# Altium project extension.PrjPcb (part 1 of 2)
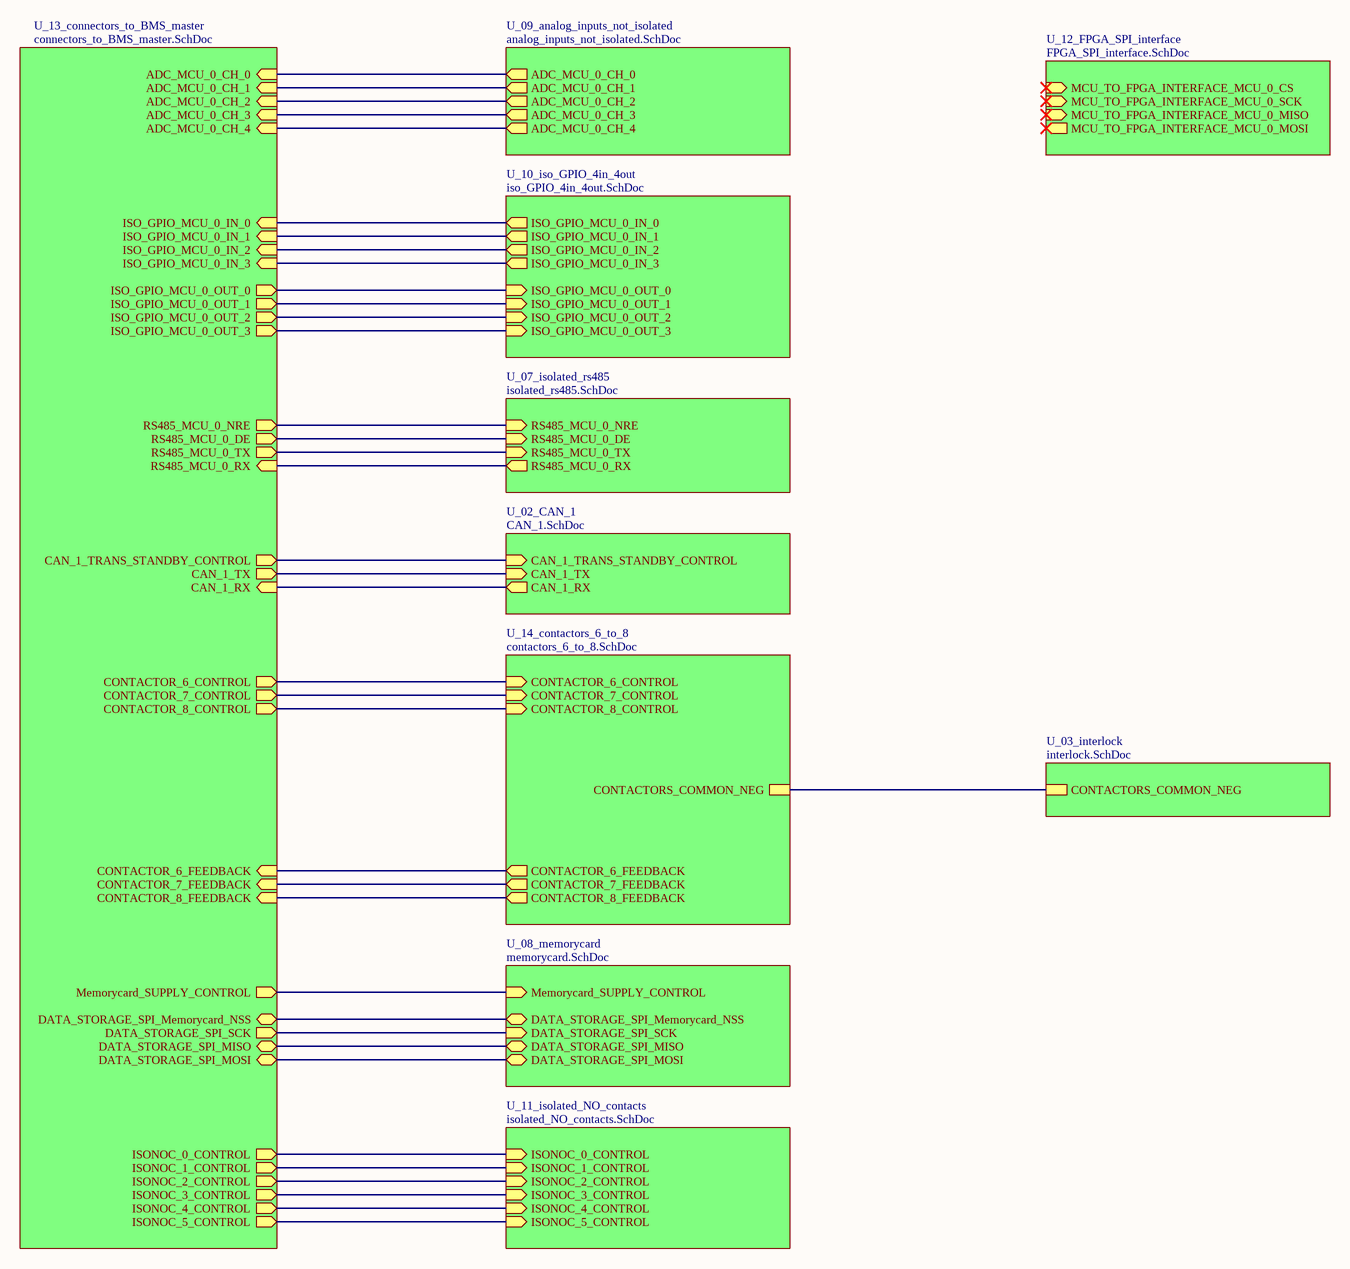
[diagram p0: hierarchy.SchDoc]
GlobalDate: 2018-10-25; GlobalLicense: Creative Commons Attribution 4.0; GlobalProject: foxBMS BMS-Extension; GlobalVersion: 1.0.5
14 sheets, 219 parts. Net scope: hierarchical (ports join the sheet entries above them; power ports are global).
Board file: extension.PcbDoc
Sheets:
  hierarchy.SchDoc
    U_02_CAN_1 = CAN_1.SchDoc
    U_03_interlock = interlock.SchDoc
    U_07_isolated_rs485 = isolated_rs485.SchDoc
    U_08_memorycard = memorycard.SchDoc
    U_09_analog_inputs_not_isolated = analog_inputs_not_isolated.SchDoc
    U_10_iso_GPIO_4in_4out = iso_GPIO_4in_4out.SchDoc
    U_11_isolated_NO_contacts = isolated_NO_contacts.SchDoc
    U_12_FPGA_SPI_interface = FPGA_SPI_interface.SchDoc
    U_13_connectors_to_BMS_master = connectors_to_BMS_master.SchDoc
    U_14_contactors_6_to_8 = contactors_6_to_8.SchDoc
      U_04_contactor_control = contactor_control.SchDoc
      U_05_contactor_feedback = contactor_feedback.SchDoc
      U_06_contactor_connectors = contactor_connectors.SchDoc

## Sheet hierarchy.SchDoc
size A3; DocumentNumber: 1; SheetNumber: 1; SheetTotal: 14; SheetDescription: Structure of Extension

### Sub-sheets
U_02_CAN_1 = CAN_1.SchDoc: CAN_1_TX (in), CAN_1_RX (out), CAN_1_TRANS_STANDBY_CONTROL (in)
U_03_interlock = interlock.SchDoc: CONTACTORS_COMMON_NEG
U_07_isolated_rs485 = isolated_rs485.SchDoc: RS485_MCU_0_RX (out), RS485_MCU_0_NRE (in), RS485_MCU_0_DE (in), RS485_MCU_0_TX (in)
U_08_memorycard = memorycard.SchDoc: DATA_STORAGE_SPI_Memorycard_NSS (bidir), Memorycard_SUPPLY_CONTROL (in), DATA_STORAGE_SPI_SCK (in), DATA_STORAGE_SPI_MISO (bidir), DATA_STORAGE_SPI_MOSI (bidir)
U_09_analog_inputs_not_isolated = analog_inputs_not_isolated.SchDoc: ADC_MCU_0_CH_0 (out), ADC_MCU_0_CH_1 (out), ADC_MCU_0_CH_2 (out), ADC_MCU_0_CH_3 (out), ADC_MCU_0_CH_4 (out)
U_10_iso_GPIO_4in_4out = iso_GPIO_4in_4out.SchDoc: ISO_GPIO_MCU_0_OUT_1 (in), ISO_GPIO_MCU_0_IN_0 (out), ISO_GPIO_MCU_0_IN_1 (out), ISO_GPIO_MCU_0_OUT_0 (in), ISO_GPIO_MCU_0_IN_2 (out), ISO_GPIO_MCU_0_IN_3 (out), ISO_GPIO_MCU_0_OUT_2 (in), ISO_GPIO_MCU_0_OUT_3 (in)
U_11_isolated_NO_contacts = isolated_NO_contacts.SchDoc: ISONOC_0_CONTROL (in), ISONOC_1_CONTROL (in), ISONOC_2_CONTROL (in), ISONOC_3_CONTROL (in), ISONOC_4_CONTROL (in), ISONOC_5_CONTROL (in)
U_12_FPGA_SPI_interface = FPGA_SPI_interface.SchDoc: MCU_TO_FPGA_INTERFACE_MCU_0_CS (in), MCU_TO_FPGA_INTERFACE_MCU_0_MOSI (out), MCU_TO_FPGA_INTERFACE_MCU_0_MISO (in), MCU_TO_FPGA_INTERFACE_MCU_0_SCK (in)
U_13_connectors_to_BMS_master = connectors_to_BMS_master.SchDoc: CAN_1_TX (out), CAN_1_RX (in), CAN_1_TRANS_STANDBY_CONTROL (out), ISONOC_5_CONTROL (out), CONTACTOR_6_CONTROL (out), CONTACTOR_7_CONTROL (out), CONTACTOR_8_CONTROL (out), CONTACTOR_6_FEEDBACK (in), CONTACTOR_7_FEEDBACK (in), CONTACTOR_8_FEEDBACK (in), RS485_MCU_0_RX (in), RS485_MCU_0_TX (out), RS485_MCU_0_DE (out), RS485_MCU_0_NRE (out), Memorycard_SUPPLY_CONTROL (out), DATA_STORAGE_SPI_Memorycard_NSS (bidir), DATA_STORAGE_SPI_MISO (bidir), DATA_STORAGE_SPI_MOSI (bidir), DATA_STORAGE_SPI_SCK (out), ADC_MCU_0_CH_0 (in), ADC_MCU_0_CH_1 (in), ADC_MCU_0_CH_2 (in), ADC_MCU_0_CH_3 (in), ADC_MCU_0_CH_4 (in), ISO_GPIO_MCU_0_IN_0 (in), ISO_GPIO_MCU_0_IN_1 (in), ISO_GPIO_MCU_0_IN_2 (in), ISO_GPIO_MCU_0_IN_3 (in), ISO_GPIO_MCU_0_OUT_0 (out), ISO_GPIO_MCU_0_OUT_1 (out), ISO_GPIO_MCU_0_OUT_2 (out), ISO_GPIO_MCU_0_OUT_3 (out), ISONOC_0_CONTROL (out), ISONOC_1_CONTROL (out), ISONOC_2_CONTROL (out), ISONOC_3_CONTROL (out), ISONOC_4_CONTROL (out)
U_14_contactors_6_to_8 = contactors_6_to_8.SchDoc: CONTACTORS_COMMON_NEG, CONTACTOR_7_FEEDBACK (out), CONTACTOR_8_FEEDBACK (out), CONTACTOR_6_FEEDBACK (out), CONTACTOR_7_CONTROL (in), CONTACTOR_6_CONTROL (in), CONTACTOR_8_CONTROL (in)

### Nets
ADC_MCU_0_CH_0: sheet U_09_analog_inputs_not_isolated/ADC_MCU_0_CH_0, sheet U_13_connectors_to_BMS_master/ADC_MCU_0_CH_0
ADC_MCU_0_CH_1: sheet U_09_analog_inputs_not_isolated/ADC_MCU_0_CH_1, sheet U_13_connectors_to_BMS_master/ADC_MCU_0_CH_1
ADC_MCU_0_CH_2: sheet U_09_analog_inputs_not_isolated/ADC_MCU_0_CH_2, sheet U_13_connectors_to_BMS_master/ADC_MCU_0_CH_2
ADC_MCU_0_CH_3: sheet U_09_analog_inputs_not_isolated/ADC_MCU_0_CH_3, sheet U_13_connectors_to_BMS_master/ADC_MCU_0_CH_3
ADC_MCU_0_CH_4: sheet U_09_analog_inputs_not_isolated/ADC_MCU_0_CH_4, sheet U_13_connectors_to_BMS_master/ADC_MCU_0_CH_4
CAN_1_RX: sheet U_02_CAN_1/CAN_1_RX, sheet U_13_connectors_to_BMS_master/CAN_1_RX
CAN_1_TRANS_STANDBY_CONTROL: sheet U_02_CAN_1/CAN_1_TRANS_STANDBY_CONTROL, sheet U_13_connectors_to_BMS_master/CAN_1_TRANS_STANDBY_CONTROL
CAN_1_TX: sheet U_02_CAN_1/CAN_1_TX, sheet U_13_connectors_to_BMS_master/CAN_1_TX
CONTACTOR_6_CONTROL: sheet U_13_connectors_to_BMS_master/CONTACTOR_6_CONTROL, sheet U_14_contactors_6_to_8/CONTACTOR_6_CONTROL
CONTACTOR_6_FEEDBACK: sheet U_13_connectors_to_BMS_master/CONTACTOR_6_FEEDBACK, sheet U_14_contactors_6_to_8/CONTACTOR_6_FEEDBACK
CONTACTOR_7_CONTROL: sheet U_13_connectors_to_BMS_master/CONTACTOR_7_CONTROL, sheet U_14_contactors_6_to_8/CONTACTOR_7_CONTROL
CONTACTOR_7_FEEDBACK: sheet U_13_connectors_to_BMS_master/CONTACTOR_7_FEEDBACK, sheet U_14_contactors_6_to_8/CONTACTOR_7_FEEDBACK
CONTACTOR_8_CONTROL: sheet U_13_connectors_to_BMS_master/CONTACTOR_8_CONTROL, sheet U_14_contactors_6_to_8/CONTACTOR_8_CONTROL
CONTACTOR_8_FEEDBACK: sheet U_13_connectors_to_BMS_master/CONTACTOR_8_FEEDBACK, sheet U_14_contactors_6_to_8/CONTACTOR_8_FEEDBACK
CONTACTORS_COMMON_NEG: sheet U_03_interlock/CONTACTORS_COMMON_NEG, sheet U_14_contactors_6_to_8/CONTACTORS_COMMON_NEG
DATA_STORAGE_SPI_Memorycard_NSS: sheet U_08_memorycard/DATA_STORAGE_SPI_Memorycard_NSS, sheet U_13_connectors_to_BMS_master/DATA_STORAGE_SPI_Memorycard_NSS
DATA_STORAGE_SPI_MISO: sheet U_08_memorycard/DATA_STORAGE_SPI_MISO, sheet U_13_connectors_to_BMS_master/DATA_STORAGE_SPI_MISO
DATA_STORAGE_SPI_MOSI: sheet U_08_memorycard/DATA_STORAGE_SPI_MOSI, sheet U_13_connectors_to_BMS_master/DATA_STORAGE_SPI_MOSI
DATA_STORAGE_SPI_SCK: sheet U_08_memorycard/DATA_STORAGE_SPI_SCK, sheet U_13_connectors_to_BMS_master/DATA_STORAGE_SPI_SCK
ISO_GPIO_MCU_0_IN_0: sheet U_10_iso_GPIO_4in_4out/ISO_GPIO_MCU_0_IN_0, sheet U_13_connectors_to_BMS_master/ISO_GPIO_MCU_0_IN_0
ISO_GPIO_MCU_0_IN_1: sheet U_10_iso_GPIO_4in_4out/ISO_GPIO_MCU_0_IN_1, sheet U_13_connectors_to_BMS_master/ISO_GPIO_MCU_0_IN_1
ISO_GPIO_MCU_0_IN_2: sheet U_10_iso_GPIO_4in_4out/ISO_GPIO_MCU_0_IN_2, sheet U_13_connectors_to_BMS_master/ISO_GPIO_MCU_0_IN_2
ISO_GPIO_MCU_0_IN_3: sheet U_10_iso_GPIO_4in_4out/ISO_GPIO_MCU_0_IN_3, sheet U_13_connectors_to_BMS_master/ISO_GPIO_MCU_0_IN_3
ISO_GPIO_MCU_0_OUT_0: sheet U_10_iso_GPIO_4in_4out/ISO_GPIO_MCU_0_OUT_0, sheet U_13_connectors_to_BMS_master/ISO_GPIO_MCU_0_OUT_0
ISO_GPIO_MCU_0_OUT_1: sheet U_10_iso_GPIO_4in_4out/ISO_GPIO_MCU_0_OUT_1, sheet U_13_connectors_to_BMS_master/ISO_GPIO_MCU_0_OUT_1
ISO_GPIO_MCU_0_OUT_2: sheet U_10_iso_GPIO_4in_4out/ISO_GPIO_MCU_0_OUT_2, sheet U_13_connectors_to_BMS_master/ISO_GPIO_MCU_0_OUT_2
ISO_GPIO_MCU_0_OUT_3: sheet U_10_iso_GPIO_4in_4out/ISO_GPIO_MCU_0_OUT_3, sheet U_13_connectors_to_BMS_master/ISO_GPIO_MCU_0_OUT_3
ISONOC_0_CONTROL: sheet U_11_isolated_NO_contacts/ISONOC_0_CONTROL, sheet U_13_connectors_to_BMS_master/ISONOC_0_CONTROL
ISONOC_1_CONTROL: sheet U_11_isolated_NO_contacts/ISONOC_1_CONTROL, sheet U_13_connectors_to_BMS_master/ISONOC_1_CONTROL
ISONOC_2_CONTROL: sheet U_11_isolated_NO_contacts/ISONOC_2_CONTROL, sheet U_13_connectors_to_BMS_master/ISONOC_2_CONTROL
ISONOC_3_CONTROL: sheet U_11_isolated_NO_contacts/ISONOC_3_CONTROL, sheet U_13_connectors_to_BMS_master/ISONOC_3_CONTROL
ISONOC_4_CONTROL: sheet U_11_isolated_NO_contacts/ISONOC_4_CONTROL, sheet U_13_connectors_to_BMS_master/ISONOC_4_CONTROL
ISONOC_5_CONTROL: sheet U_11_isolated_NO_contacts/ISONOC_5_CONTROL, sheet U_13_connectors_to_BMS_master/ISONOC_5_CONTROL
Memorycard_SUPPLY_CONTROL: sheet U_08_memorycard/Memorycard_SUPPLY_CONTROL, sheet U_13_connectors_to_BMS_master/Memorycard_SUPPLY_CONTROL
RS485_MCU_0_DE: sheet U_07_isolated_rs485/RS485_MCU_0_DE, sheet U_13_connectors_to_BMS_master/RS485_MCU_0_DE
RS485_MCU_0_NRE: sheet U_07_isolated_rs485/RS485_MCU_0_NRE, sheet U_13_connectors_to_BMS_master/RS485_MCU_0_NRE
RS485_MCU_0_RX: sheet U_07_isolated_rs485/RS485_MCU_0_RX, sheet U_13_connectors_to_BMS_master/RS485_MCU_0_RX
RS485_MCU_0_TX: sheet U_07_isolated_rs485/RS485_MCU_0_TX, sheet U_13_connectors_to_BMS_master/RS485_MCU_0_TX

### Notes on the sheet
- Fraunhofer IISB
- Schottkystr. 10
- developed by:
- 91058 Erlangen
- Germany
- Author
- Project
- License
- Description
- File
- Version
- Release Date
- Sheet
- www.foxbms.org
- www.iisb.fraunhofer.de
- foxBMS Team
- /

## Sheet CAN_1.SchDoc: foxBMS BMS-Extension
size A3; DocumentNumber: 8; SheetNumber: 8; SheetTotal: 14; Author: Fraunhofer IISB foxBMS Team; REL-DATE: 2017-05-16; VERSION: 1.0.2; GateName_1: G$1; SymbolName_1: FRAME_B_L; LibraryName: foxBMS_BMS-Master_V1.00_A; DeviceSetName: FRAME_B_L; GateName_2: G$2; SymbolName_2: DOCFIELD; SheetDescription: CAN Interface 1
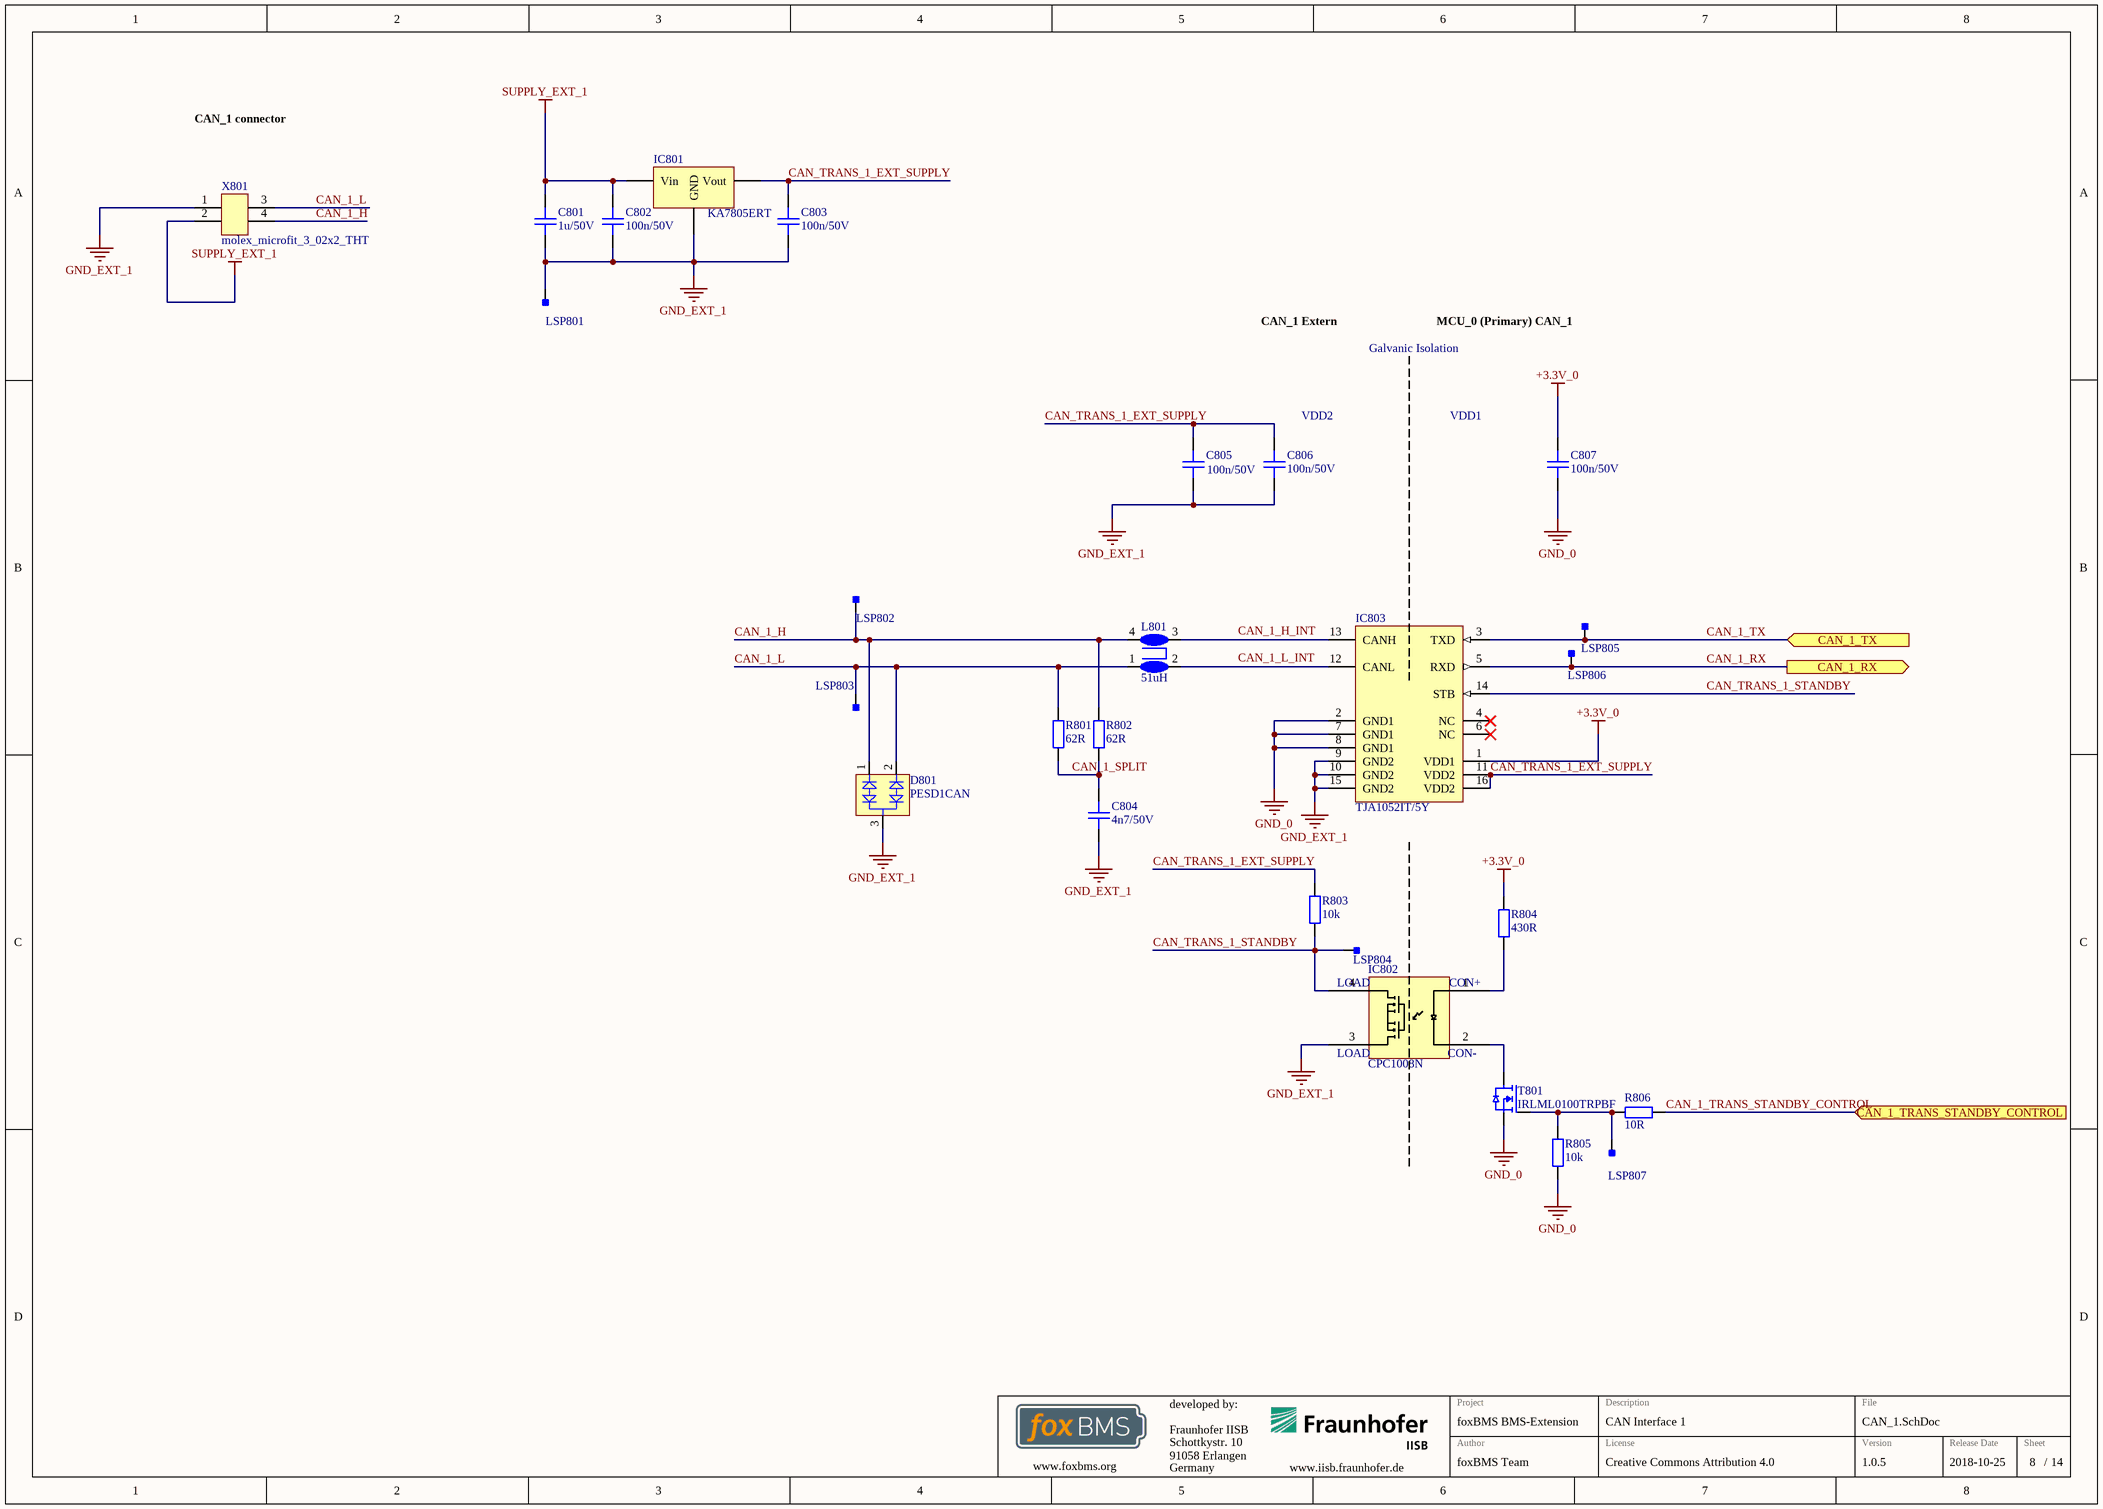
[diagram p1: CAN_1.SchDoc]

### Parts
C801  1u/50V  [CAPC1608X08N]
C802  100n/50V  [CAPC1608X08N]
C803  100n/50V  [CAPC1608X08N]
C804  4n7/50V  [CAPC1608X08N]
C805  100n/50V  [CAPC1608X08N]
C806  100n/50V  [CAPC1608X08N]
C807  100n/50V  [CAPC1608X08N]
D801  PESD1CAN  [NXP-SOT23-3_V]
IC801  KA7805ERT  [DPAK228P950X240-3N]
IC802  CPC1008N  [SOP254P610X218-4N]
IC803  TJA1052IT/5Y  [NXP-SOIC-16_L]
L801  51uH  [B82789C0/S0]
LSP801  Testpoint_Square  [Testpoint_S1]  (value not drawn)  (no BOM)
LSP802  Testpoint_Square  [Testpoint_S1]  (value not drawn)  (no BOM)
LSP803  Testpoint_Square  [Testpoint_S1]  (value not drawn)  (no BOM)
LSP804  Testpoint_Square  [Testpoint_S1]  (value not drawn)  (no BOM)
LSP805  Testpoint_Square  [Testpoint_S1]  (value not drawn)  (no BOM)
LSP806  Testpoint_Square  [Testpoint_S1]  (value not drawn)  (no BOM)
LSP807  Testpoint_Square  [Testpoint_S1]  (value not drawn)  (no BOM)
R801  62R  [RESC1608X05N]
R802  62R  [RESC1608X05N]
R803  10k  [RESC1608X05N]
R804  430R  [RESC1608X05N]
R805  10k  [RESC1608X05N]
R806  10R  [RESC1608X05N]
T801  IRLML0100TRPBF  [SOT95P237X110-3N]
X801  molex_microfit_3_02x2_THT  [MOLEX_MICROFIT_02x2_THT]

### Ports
CAN_1_RX (out), CAN_1_TRANS_STANDBY_CONTROL (in), CAN_1_TX (in)

### Nets
+3.3V_0: C807.2 IC803.1(VDD1) R804.1
GND_0: C807.1 IC803.2(GND1) IC803.7(GND1) IC803.8(GND1) R805.2 T801.S
GND_EXT_1: C801.1 C802.1 C803.1 C804.2 C805.1 C806.1 D801.3(C) IC801.2(GND) IC802.3 IC803.9(GND2) IC803.10(GND2) IC803.15(GND2) LSP801.1 X801.1
SUPPLY_EXT_1: C801.2 C802.2 IC801.1(Vin) X801.2
CAN_1_H: D801.1(K1) L801.4 LSP802.1 R802.2 X801.4
CAN_1_L: D801.2(K2) L801.1 LSP803.1 R801.1 X801.3
CAN_1_RX: IC803.5(RXD) LSP806.1 ; port CAN_1_RX
CAN_1_SPLIT: C804.1 R801.2 R802.1
CAN_1_TRANS_STANDBY_CONTROL: R806.2 ; port CAN_1_TRANS_STANDBY_CONTROL
CAN_1_TX: IC803.3(TXD) LSP805.1 ; port CAN_1_TX
CAN_TRANS_1_EXT_SUPPLY: C803.2 C805.2 C806.2 IC801.3(Vout) IC803.11(VDD2) IC803.16(VDD2) R803.1
CAN_TRANS_1_STANDBY: IC802.4 IC803.14(STB) LSP804.1 R803.2
NetIC802_1: IC802.1 R804.2
NetIC802_2: IC802.2 T801.D
NetIC803_12: IC803.12(CANL) L801.2
NetIC803_13: IC803.13(CANH) L801.3
NetLSP807_1: LSP807.1 R805.1 R806.1 T801.G

Not connected (* = marked no-connect by the designer): IC803 4(NC)* 6(NC)*

### Notes on the sheet
- CAN_1 connector
- CAN_1 Extern
- Galvanic Isolation
- MCU_0 (Primary) CAN_1
- (near C806) VDD2
- VDD1
- Labels drawn without touching a wire or pin: CAN_1_H_INT, CAN_1_L_INT
- Fraunhofer IISB
- Schottkystr. 10
- developed by:
- 91058 Erlangen
- Germany
- Author
- Project
- License
- Description
- File
- Version
- Release Date
- Sheet
- www.foxbms.org
- www.iisb.fraunhofer.de
- foxBMS Team
- /
- (in symbol CPC1008N) LOAD; CON+; CON-

### Library data of the parts
C801 = gen_C_ceramic_1u_50V_X7R_0603: MLCC; Capacitance: 1u; Rated Voltage: 50V; Dielectric: X7R; Case EIA: 0603; Case Metric: 1608; Tolerance: ± 10%; Part Number: gen_C_ceramic_1u_50V_X7R_0603; Operating Temperature: -55°C - +125°C; Supplier 1: Farnell; Supplier Part Number 1: 2779055
C802 C803 C805-C807 = gen_C_ceramic_100n_50V_X7R_0603: MLCC; Capacitance: 100n; Rated Voltage: 50V; Dielectric: X7R; Case EIA: 0603; Case Metric: 1608; PnP Package: C_0603_10; PnP Value: 100n/50V/X7R; PnP equipped: x; Part Number: gen_C_ceramic_100n_50V_X7R_0603; Supplier 1: Farnell; Supplier Part Number 1: 2525267
C804 = gen_C_ceramic_4n7_50V_X7R_0603: MLCC; Capacitance: 4n7; Rated Voltage: 50V; Dielectric: X7R; Case EIA: 0603; Case Metric: 1608; PnP Package: C_0603_05; Automotive Qualified: True; Part Number: gen_C_ceramic_4n7_50V_X7R_0603; Supplier 1: Farnell; Supplier Part Number 1: 2904754
D801 = CMP-2000-04916-1: CAN Bus ESD Protection Diode, 200 W, 24 V, -65 to 150 degC, 3-Pin SOT23, RoHS, Tape and Reel; Manufacturer: NXP Semiconductors; SVHC: NoSVHC(20-Jun-2013); Reverse Stand-Off Voltage Vrwm: 24V; Breakdown Voltage Max: 30.3V; Capacitance Cd @ Vr Typ: 11pF; TVS Polarity: Bidirectional; Peak Pulse Power: 200W; Breakdown Voltage Min: 25.4V; Clamping Voltage @ 8/20µs Max: 70V; Peak Pulse Current Ippm: 3A; SMD Marking: AN; Diode Case Style: SOT-23; Breakdown Voltage: 27.8V; Breakdown Voltage Range: 25.4Vto30.3V; Capacitance Cd @ Vr Max: 17pF; No. of Pins: 3; Diode Type: BidirectionalTVS; Termination Type: SMD; Operating Temperature Max: 150degC; Datasheet URL: https://datasheet.ciiva.com/22692/109497-22692467.pdf; Package / Case: SOT-23; Diode Configuration: Bidirectional; Operating Temperature Min: -65degC; Stand-off Voltage: 24V; Datasheet Version: Rev. 04, 02/2008; Manufacturer URL: http://www.nxp.com/; Operating Temperature Range: -65degCto+150degC; Breakover Voltage Min: 25.4V; Clamping Voltage Vc Max: 70V
IC801 = KA7805ERTF: 3-Terminal 1 A Positive Voltage Regulator; Manufacturer: Fairchild; Part Number: KA7805ERTF; Part Name: KA7805ERTF; Operating Temperature: -40°C - +125°C; ComponentLink1Description: Datasheet; ComponentLink1URL: http://www.farnell.com/datasheets/2299720.pdf; Supplier 1: Farnell; Supplier Part Number 1: 2102585
IC802 = CPC1008N: Single-Pole, Normally Open 4-Pin SOP OptoMOS Relay; Manufacturer: CLARE; Part Number: CPC1008N; Part Name: CPC1008N; Operating Temperature: -40°C - +85°C; ComponentLink1Description: Datasheet; ComponentLink1URL: http://www.farnell.com/datasheets/1924621.pdf; Supplier 1: Farnell; Supplier Part Number 1: 1653755
IC803 = CMP-2000-07246-1: Galvanically Isolated High-Speed CAN Transceiver, -40 to 125 degC, 16-Pin SOIC, RoHS, Tape and Reel; Manufacturer: NXPSemiconductors; Rad Hard: No; Minimum Single Supply Voltage: 3; Maximum Single Supply Voltage: 5.25V; Power Down Mode: Standby; Maximum Data Rate: 1Mbps; Standard Supported: ISO11898-2; Number of Transceivers: 1; Package Description: 16-Pin Small Outline Integrated Circuit, Body 10.3 x 7.5 mm, Pitch 1.27 mm; Package: 16SOIC; Datasheet URL: http://www.nxp.com/documents/data_sheet/TJA1052I.pdf; Category: Transceiver; Manufacturer URL: http://www.nxp.com/; Datasheet Version: Rev. 3, 01/2015; Packaging: Tape&Reel; Package Reference: SOT162-1; Mounting Technology: SurfaceMount
L801 = B82789N: Common Mode Choke; Manufacturer: EPCOS / TDK; Rated Current: 250mA; Part Number: B82789N; Operating Temperature: -55°C - +150°C; ComponentLink1Description: Datasheet; ComponentLink1URL: https://www.mouser.com/ds/2/400/b82789c0_s0-1220172.pdf; Inductance: 51uH; Supplier 1: Mouser; Supplier Part Number 1: 871-B82789C0513H002
LSP801-LSP807 = Testpoint_Square: Testpoint, square; Part Number: Testpoint_Square
R801 R802 = gen_R_62R_0603: SMD Resistor 62R 0603; Tolerance: 1%; Power: 0.1W; Case EIA: 0603; Case Metric: 1608; Maximum Working Voltage: 75V; PnP Package: R_0603; Part Number: gen_R_62R_0603; Operating Temperature: -55°C - +155°C; Resistance: 62R; Series: E24; PnP Value: 62R; Supplier 1: Farnell; Supplier Part Number 1: 2073943
R803 R805 = gen_R_10k_0603: SMD Resistor 10k 0603; Tolerance: 1%; Power: 0.1W; Case EIA: 0603; Case Metric: 1608; Maximum Working Voltage: 75V; PnP Package: R_0603; Part Number: gen_R_10k_0603; Operating Temperature: -55°C - +155°C; Resistance: 10k; Series: E24, E96; PnP Value: 10k; Supplier 1: Farnell; Supplier Part Number 1: 2073349
R804 = gen_R_430R_0603: SMD Resistor 430R 0603; Tolerance: 1%; Power: 0.1W; Case EIA: 0603; Case Metric: 1608; Maximum Working Voltage: 75V; PnP Package: R_0603; Part Number: gen_R_430R_0603; Operating Temperature: -55°C - +155°C; Resistance: 430R; Series: E24; PnP Value: 430R; Supplier 1: Farnell; Supplier Part Number 1: 2074259
R806 = gen_R_10R_0603: SMD Resistor 10R 0603; Tolerance: 1%; Power: 0.1W; Case EIA: 0603; Case Metric: 1608; Maximum Working Voltage: 75V; PnP Package: R_0603; Part Number: gen_R_10R_0603; Operating Temperature: -55°C - +155°C; Resistance: 10R; Series: E24, E96; PnP Value: 10R; Supplier 1: Farnell; Supplier Part Number 1: 2073361
T801 = IRLML0100TRPBF: MOSFET-Transistor, n-Kanal, 1.6 A, 100 V, 0.178 ohm, 10 V, 2.5 V; Manufacturer: Infineon; Maximum Drain-Source Voltage: 100V; Maximum Continous Drain Current (25°C): 1.6A; R_DS(on): 190m; Total Gate Charge: 2.5nC; Part Number: IRLML0100TRPBF; Part Name: NMOS; Operating Temperature: -55°C - +150°C; ComponentLink1Description: Datasheet URL; ComponentLink1URL: http://www.farnell.com/datasheets/491501.pdf; Supplier 1: Farnell; Supplier Part Number 1: 1783928
X801 = molex_microfit_3_02x2_THT: Micro-Fit 3.0 Right Angle Header, 3.00mm Pitch, Dual Row, 4 Circuits, with Snap-in Plastic Peg PCB Lock, Tin, Glow Wire Capable, Black, 43045-0400; Manufacturer: Molex; Circuits: 4; Rated Voltage: 600V; Rated Current: 8.5A; Part Number: molex_microfit_3_02x2_THT; Part Name: MicroFit; Operating Temperature: -40°C - +105°C; Supplier 1: Farnell; Supplier Part Number 1: 9733019

## Sheet interlock.SchDoc: foxBMS BMS-Extension
size A3; DocumentNumber: 7; SheetNumber: 7; SheetTotal: 14; Author: Fraunhofer IISB foxBMS Team; REL-DATE: 2017-05-16; VERSION: 1.0.2; GateName_1: G$1; SymbolName_1: FRAME_B_L; LibraryName: foxBMS_BMS-Master_V1.00_A; DeviceSetName: FRAME_B_L; GateName_2: G$2; SymbolName_2: DOCFIELD; SheetDescription: Interlock Circuit
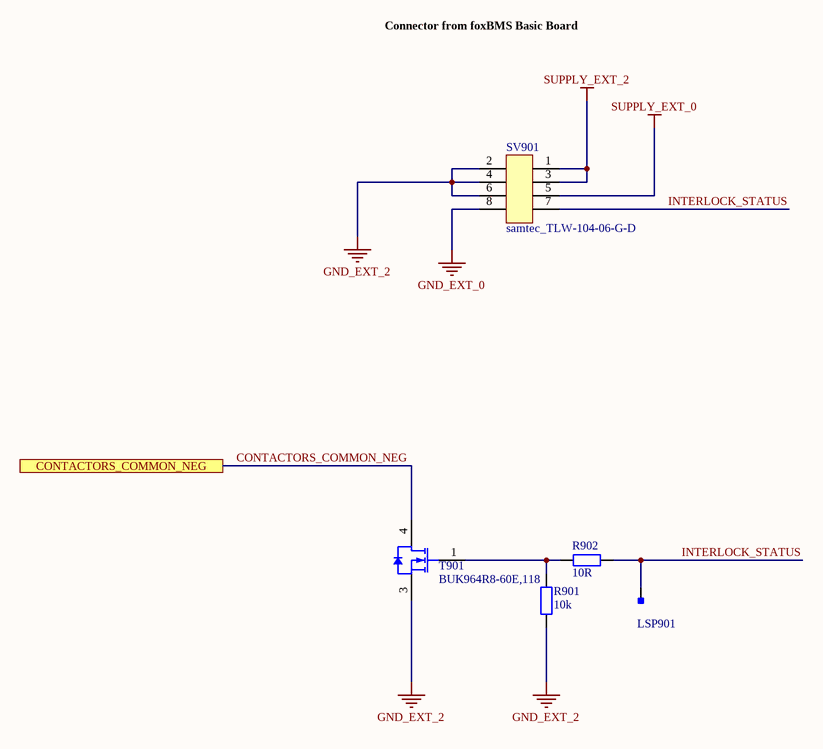
[diagram p2: interlock.SchDoc]

### Parts
LSP901  Testpoint_Square  [Testpoint_S1]  (value not drawn)  (no BOM)
R901  10k  [RESC1608X05N]
R902  10R  [RESC1608X05N]
SV901  samtec_TLW-104-06-G-D  [Pinheader_2.54_2x4]
T901  BUK964R8-60E,118  [NXP-SOT404_M]

### Ports
CONTACTORS_COMMON_NEG

### Nets
GND_EXT_0: SV901.8
GND_EXT_2: R901.2 SV901.2 SV901.4 SV901.6 T901.3(S)
SUPPLY_EXT_0: SV901.5
SUPPLY_EXT_2: SV901.1 SV901.3
CONTACTORS_COMMON_NEG: T901.4(D) ; port CONTACTORS_COMMON_NEG
INTERLOCK_STATUS: LSP901.1 R902.2 SV901.7
NetR901_1: R901.1 R902.1 T901.1(G)

### Notes on the sheet
- Connector from foxBMS Basic Board
- Fraunhofer IISB
- Schottkystr. 10
- developed by:
- 91058 Erlangen
- Germany
- Author
- Project
- License
- Description
- File
- Version
- Release Date
- Sheet
- www.foxbms.org
- www.iisb.fraunhofer.de
- foxBMS Team
- /

### Library data of the parts
LSP901 = Testpoint_Square: Testpoint, square; Part Number: Testpoint_Square
R901 = gen_R_10k_0603: as R803 on sheet CAN_1; Part Number: gen_R_10k_0603; Operating Temperature: -55°C - +155°C; Resistance: 10k; Series: E24, E96; PnP Value: 10k; Supplier 1: Farnell; Supplier Part Number 1: 2073349
R902 = gen_R_10R_0603: as R806 on sheet CAN_1; Part Number: gen_R_10R_0603; Operating Temperature: -55°C - +155°C; Resistance: 10R; Series: E24, E96; PnP Value: 10R; Supplier 1: Farnell; Supplier Part Number 1: 2073361
SV901 = samtec_TLW-104-06-G-D: Board-To-Board Connector, Vertical, Low Profile, 2.54 mm, 8 Contacts, Header, TLW Series, Through Hole, 2 Rows; Manufacturer: Samtec; Circuits: 8; Part Number: samtec_TLW-104-06-G-D; Part Name: TLW-104-06-G-D; Operating Temperature: -55°C - +125°C; Supplier 1: Digikey; Supplier Part Number 1: SAM1096-04-ND; ComponentLink1Description: Datasheet; ComponentLink1URL: http://suddendocs.samtec.com/catalog_english/tlw_th.pdf
T901 = CMP-1259-00124-1: N-Channel TrenchMOS Logic Level FET, 60 V, 100 A, 3-Pin SOT404, Tape and Reel; Manufacturer: NXP Semiconductors; Channel Type: N; ID [max] (A): 100; Automotive Qualified: Y; IDM [max] (A): 596; VGSth [typ] (V): 1.7; VDS [max] (V): 60; Packing: Tape & Reel; Qr [typ] (nC): 56; PackageDescription: 3-Pin Plastic Single-ended Surface Mounted Package, Body 10 x 9.6 mm, Pitch 2.54 mm; Mounting Technology: Surface Mount; ComponentLink3URL: http://www.nxp.com/documents/outline_drawing/sot404_po.pdf; ComponentLink1Description: Manufacturer URL; ComponentLink2URL: http://www.nxp.com/documents/data_sheet/BUK964R8-60E.pdf; PackageVersion: 13-02-25, 02/2013; ComponentLink2Description: Datasheet; PartNumber: BUK964R8-60E,118; ComponentLink1URL: http://www.nxp.com/; ComponentLink3Description: Package Specification; PackageReference: SOT404

## Sheet isolated_rs485.SchDoc: foxBMS BMS-Extension
size A3; DocumentNumber: 9; SheetNumber: 9; SheetTotal: 14; Author: Fraunhofer IISB foxBMS Team; REL-DATE: 2017-05-16; VERSION: 1.0.2; GateName_1: G$1; SymbolName_1: FRAME_B_L; LibraryName: foxBMS_BMS-Master_V1.00_A; DeviceSetName: FRAME_B_L; GateName_2: G$2; SymbolName_2: DOCFIELD; SheetDescription: Isolated RS485
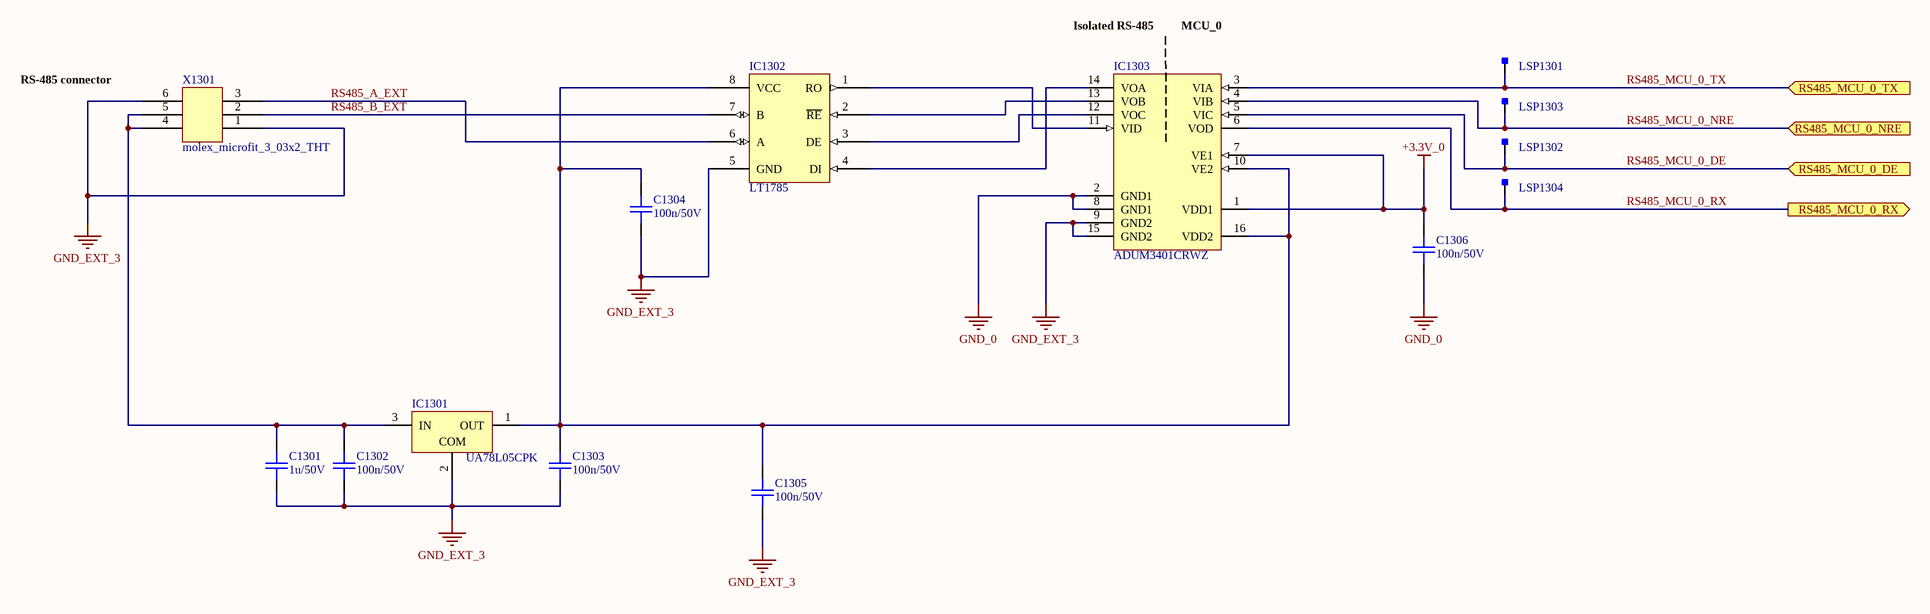
[diagram p3: isolated_rs485.SchDoc]

### Parts
C1301  1u/50V  [CAPC1608X08N]
C1302  100n/50V  [CAPC1608X08N]
C1303  100n/50V  [CAPC1608X08N]
C1304  100n/50V  [CAPC1608X08N]
C1305  100n/50V  [CAPC1608X08N]
C1306  100n/50V  [CAPC1608X08N]
IC1301  UA78L05CPK  [PK0003A_L]
IC1302  LT1785  [SOIC127P600X175-8N]
IC1303  ADUM3401CRWZ  [ADI-RW-16_N]
LSP1301  Testpoint_Square  [Testpoint_S1]  (value not drawn)  (no BOM)
LSP1302  Testpoint_Square  [Testpoint_S1]  (value not drawn)  (no BOM)
LSP1303  Testpoint_Square  [Testpoint_S1]  (value not drawn)  (no BOM)
LSP1304  Testpoint_Square  [Testpoint_S1]  (value not drawn)  (no BOM)
X1301  molex_microfit_3_03x2_THT  [MOLEX_MICROFIT_03x2_THT]

### Ports
RS485_MCU_0_DE (in), RS485_MCU_0_NRE (in), RS485_MCU_0_RX (out), RS485_MCU_0_TX (in)

### Nets
+3.3V_0: C1306.1 IC1303.1(VDD1) IC1303.7(VE1)
GND_0: C1306.2 IC1303.2(GND1) IC1303.8(GND1)
GND_EXT_3: C1301.2 C1302.2 C1303.2 C1304.2 C1305.2 IC1301.2(COM) IC1302.5(GND) IC1303.9(GND2) IC1303.15(GND2) X1301.1 X1301.6
RS485_A_EXT: IC1302.6(A) X1301.3
RS485_B_EXT: IC1302.7(B) X1301.2
RS485_MCU_0_DE: IC1303.5(VIC) LSP1302.1 ; port RS485_MCU_0_DE
RS485_MCU_0_NRE: IC1303.4(VIB) LSP1303.1 ; port RS485_MCU_0_NRE
RS485_MCU_0_RX: IC1303.6(VOD) LSP1304.1 ; port RS485_MCU_0_RX
RS485_MCU_0_TX: IC1303.3(VIA) LSP1301.1 ; port RS485_MCU_0_TX
NetC1301_1: C1301.1 C1302.1 IC1301.3(IN) X1301.4 X1301.5
NetC1303_1: C1303.1 C1304.1 C1305.1 IC1301.1(OUT) IC1302.8(VCC) IC1303.10(VE2) IC1303.16(VDD2)
NetIC1302_1: IC1302.1(RO) IC1303.11(VID)
NetIC1302_2: IC1302.2(~{RE}) IC1303.13(VOB)
NetIC1302_3: IC1302.3(DE) IC1303.12(VOC)
NetIC1302_4: IC1302.4(DI) IC1303.14(VOA)

### Notes on the sheet
- Isolated RS-485
- MCU_0
- RS-485 connector
- Fraunhofer IISB
- Schottkystr. 10
- developed by:
- 91058 Erlangen
- Germany
- Author
- Project
- License
- Description
- File
- Version
- Release Date
- Sheet
- www.foxbms.org
- www.iisb.fraunhofer.de
- foxBMS Team
- /

### Library data of the parts
C1301 = gen_C_ceramic_1u_50V_X7R_0603: MLCC; Capacitance: 1u; Rated Voltage: 50V; Dielectric: X7R; Tolerance: ± 10%; Case EIA: 0603; Case Metric: 1608; Part Number: gen_C_ceramic_1u_50V_X7R_0603; Operating Temperature: -55°C - +125°C; Supplier 1: Farnell; Supplier Part Number 1: 2779055
C1302-C1306 = gen_C_ceramic_100n_50V_X7R_0603: as C802 on sheet CAN_1; Part Number: gen_C_ceramic_100n_50V_X7R_0603; Supplier 1: Farnell; Supplier Part Number 1: 2525267
IC1301 = CMP-2000-07341-1: Positive-Voltage Regulator, 100 mA, 0 to 125 degC, 3-Pin SOT-89 (PK), Green (RoHS & no Sb/Br), Tape and Reel; Manufacturer: TexasInstruments; Load Regulation: 60mV; Input Voltage MIN: 7V; Number of Outputs: 1; Input Voltage MAX: 20V; Output Type: Fixed; Output Current: 100mA; Output Voltage: 5V; PSRR / Ripple Rejection - Typ: 49dB; Line Regulation: 200mV; Mounting Style: SMD/SMT; Datasheet Version: Rev. U, 05/2011; Polarity: Positive; Minimum Operating Temperature: 0C; Package Reference: PK0003A; Brand: TexasInstruments; Packaging: Reel; Product Category: LinearVoltageRegulators; RoHS: True; Datasheet URL: http://www.ti.com/lit/ds/symlink/ua78l05.pdf; Package URL: http://www.ti.com/lit/ml/mhsi001b/mhsi001b.pdf; Series: UA78L05; Manufacturer URL: http://www.ti.com/; Package Description: 3-Pin Small Outline Transistor, Body 4.5 x 2.5 mm, Pitch 1.5 mm; Mounting Technology: SurfaceMount; Package / Case: SOT-89-4; Maximum Operating Temperature: +125C
IC1302 = LT1785CS8#PBF: Transceiver RS422/RS485, Fault Protected, 4.75V-5.25V supply, SOIC-8; Manufacturer: Linear Technology; Part Number: LT1785CS8#PBF; Part Name: LT1785CS8; Operating Temperature: 0°C - 70°C; ComponentLink1Description: Datasheet; ComponentLink1URL: http://www.farnell.com/datasheets/1905888.pdf; Supplier 1: Farnell; Supplier Part Number 1: 1663498
IC1303 = CMP-0534-00405-1: Quad Channel Digital Isolator, Enhanced System-Level ESD Reliability, 2.5 KV rms Insulation Rating, 90 Mbps Data Rate, 32 ns Delay, Industrial, 16-pin SOIC (RW-16), Tube; Manufacturer: Analog Devices; Insulation Rating (kVrms): 2.5; Max Data Rate: 90Mbps; PackageDescription: 16-Pin Standard Small Outline Package, Body 10.3 x 7.5 mm, Pitch 1.27 mm; ComponentLink2Description: Datasheet; Mounting Technology: Surface Mount; ComponentLink2URL: http://www.analog.com/static/imported-files/data_sheets/ADUM3400_3401_3402.pdf; ComponentLink4URL: Product URL:http://www.analog.com/en/interface-isolation/digital-isolators/adum3401/products/product.html; ComponentLink1URL: http://www.analog.com/en/index.html; ComponentLink1Description: Manufacturer URL; Max Operating Temp (degreesC): 105; PartNumber: ADUM3401CRWZ; Code_JEDEC: MS-013-AA; PackageVersion: 032707-B, 03/2007; ComponentLink3URL: http://www.analog.com/static/imported-files/packages/PKG_PDF/SOIC_WIDE%20%28RW%29/RW_16.pdf; DatasheetVersion: Rev. B; PackageReference: RW-16; ComponentLink4Description: URL Link1; ComponentLink3Description: Package Specification
LSP1301-LSP1304 = Testpoint_Square: Testpoint, square; Part Number: Testpoint_Square
X1301 = molex_microfit_3_03x2_THT: Micro-Fit 3.0 Right Angle Header, 3.00mm Pitch, Dual Row, 6 Circuits, with Snap-in Plastic Peg PCB Lock, Tin, Glow Wire Capable, Black, 43045-0600; Manufacturer: Molex; Circuits: 6; Rated Voltage: 600V; Rated Current: 8.5A; Part Number: molex_microfit_3_03x2_THT; Part Name: MicroFit; Operating Temperature: -40°C - +105°C; Supplier 1: Farnell; Supplier Part Number 1: 1012252

## Sheet memorycard.SchDoc: foxBMS BMS-Extension
size A3; DocumentNumber: 10; SheetNumber: 10; SheetTotal: 14; Author: Fraunhofer IISB foxBMS Team; REL-DATE: 2017-05-16; VERSION: 1.0.2; GateName_1: G$1; SymbolName_1: FRAME_B_L; LibraryName: foxBMS_BMS-Master_V1.00_A; DeviceSetName: FRAME_B_L; GateName_2: G$2; SymbolName_2: DOCFIELD; SheetDescription: Memorycard
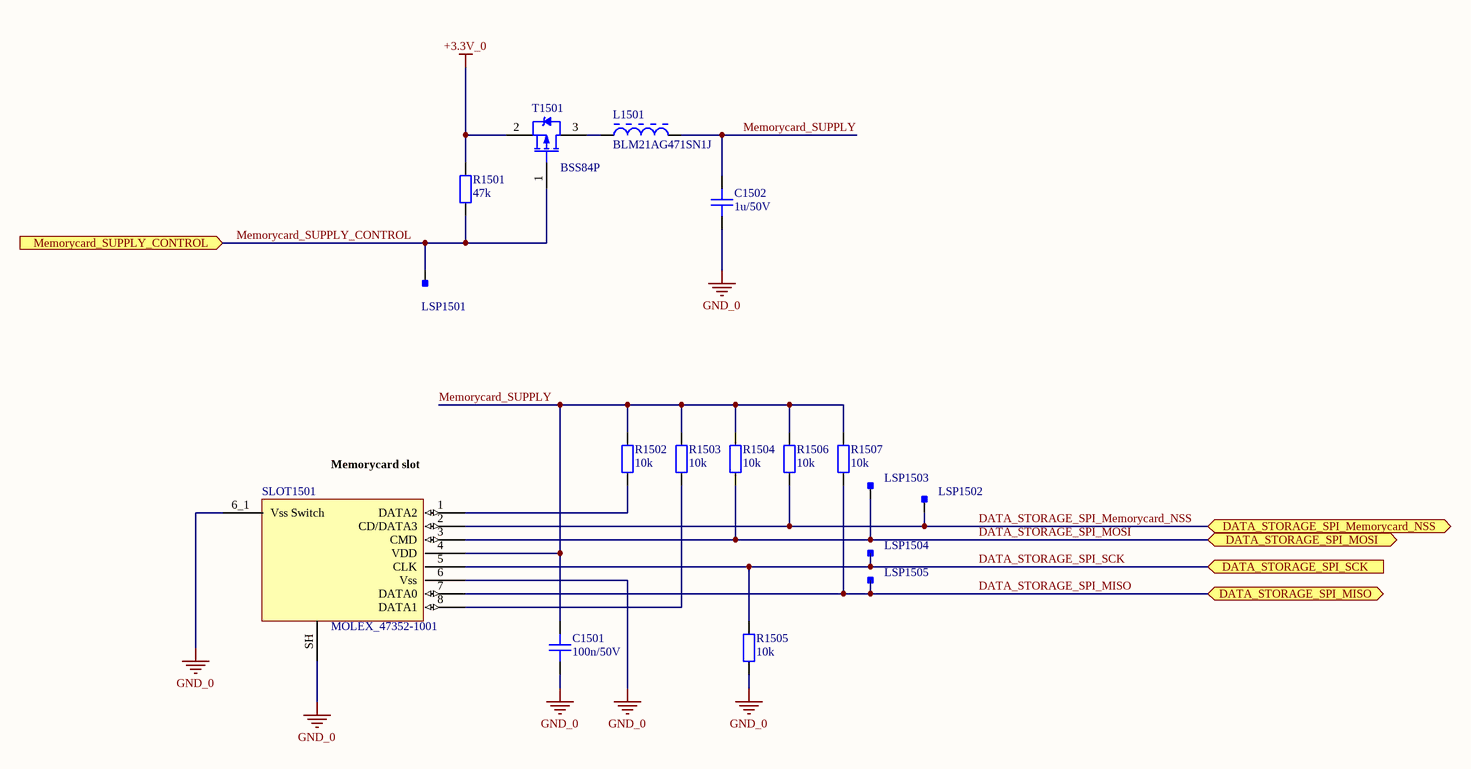
[diagram p4: memorycard.SchDoc]

### Parts
C1501  100n/50V  [CAPC1608X08N]
C1502  1u/50V  [CAPC1608X08N]
L1501  BLM21AG471SN1J  [MURA-BLM21-H1-CHIP-2_V]
LSP1501  Testpoint_Square  [Testpoint_S1]  (value not drawn)  (no BOM)
LSP1502  Testpoint_Square  [Testpoint_S1]  (value not drawn)  (no BOM)
LSP1503  Testpoint_Square  [Testpoint_S1]  (value not drawn)  (no BOM)
LSP1504  Testpoint_Square  [Testpoint_S1]  (value not drawn)  (no BOM)
LSP1505  Testpoint_Square  [Testpoint_S1]  (value not drawn)  (no BOM)
R1501  47k  [RESC1608X05N]
R1502  10k  [RESC1608X05N]
R1503  10k  [RESC1608X05N]
R1504  10k  [RESC1608X05N]
R1505  10k  [RESC1608X05N]
R1506  10k  [RESC1608X05N]
R1507  10k  [RESC1608X05N]
SLOT1501  MOLEX_47352-1001  [MOLEX_47352_1001]
T1501  BSS84P  [INF-PG-SOT23_N]

### Ports
DATA_STORAGE_SPI_Memorycard_NSS (bidir), DATA_STORAGE_SPI_MISO (bidir), DATA_STORAGE_SPI_MOSI (bidir), DATA_STORAGE_SPI_SCK (in), Memorycard_SUPPLY_CONTROL (in)

### Nets
+3.3V_0: R1501.2 T1501.2(SOURCE)
GND_0: C1501.1 C1502.2 R1505.1 SLOT1501.6(Vss) SLOT1501.6_1(Vss_Switch) SLOT1501.SH
DATA_STORAGE_SPI_Memorycard_NSS: LSP1502.1 R1506.1 SLOT1501.2(CD/DATA3) ; port DATA_STORAGE_SPI_Memorycard_NSS
DATA_STORAGE_SPI_MISO: LSP1505.1 R1507.1 SLOT1501.7(DATA0) ; port DATA_STORAGE_SPI_MISO
DATA_STORAGE_SPI_MOSI: LSP1503.1 R1504.1 SLOT1501.3(CMD) ; port DATA_STORAGE_SPI_MOSI
DATA_STORAGE_SPI_SCK: LSP1504.1 R1505.2 SLOT1501.5(CLK) ; port DATA_STORAGE_SPI_SCK
Memorycard_SUPPLY: C1501.2 C1502.1 L1501.1 R1502.2 R1503.2 R1504.2 R1506.2 R1507.2 SLOT1501.4(VDD)
Memorycard_SUPPLY_CONTROL: LSP1501.1 R1501.1 T1501.1(GATE) ; port Memorycard_SUPPLY_CONTROL
NetL1501_2: L1501.2 T1501.3(DRAIN)
NetR1502_1: R1502.1 SLOT1501.1(DATA2)
NetR1503_1: R1503.1 SLOT1501.8(DATA1)

### Notes on the sheet
- (near SLOT1501) Memorycard slot
- Fraunhofer IISB
- Schottkystr. 10
- developed by:
- 91058 Erlangen
- Germany
- Author
- Project
- License
- Description
- File
- Version
- Release Date
- Sheet
- www.foxbms.org
- www.iisb.fraunhofer.de
- foxBMS Team
- /

### Library data of the parts
C1501 = gen_C_ceramic_100n_50V_X7R_0603: as C802 on sheet CAN_1; Part Number: gen_C_ceramic_100n_50V_X7R_0603; Supplier 1: Farnell; Supplier Part Number 1: 2525267
C1502 = gen_C_ceramic_1u_50V_X7R_0603: as C1301 on sheet isolated_rs485; Part Number: gen_C_ceramic_1u_50V_X7R_0603; Operating Temperature: -55°C - +125°C; Supplier 1: Farnell; Supplier Part Number 1: 2779055
L1501 = CMP-0686-00649-2: Chip Ferrite Bead for General Signal lines, 470 Ohm, 700 mA, -55 to 125 degC, 2 x 1.25 x 1.05 mm SMD, Tape and Reel; Manufacturer: Murata; DC Resistance: 0.19 Ohm Max.; Impedance (at 100 MHz): 470 Ohm +/- 25%; Rated Current: 700 mA; ComponentLink1URL: http://www.murata.com/; Packing: Tape and Reel; PackageDescription: 2-Pin Chip, Body 2 x 1.25 mm; ComponentLink3Description: Package Specification; Operating Temperature Range: -55 to 125 degC; ComponentLink1Description: Manufacturer URL; PartNumber: BLM21AG471SN1J; DatasheetVersion: 08/2013; Mounting Technology: Surface Mount; ComponentLink2URL: http://www.murata.com/products/catalog/pdf/c31e.pdf; ComponentLink3URL: http://www.murata.com/products/catalog/pdf/c31e.pdf; ComponentLink2Description: Datasheet; PackageReference: BLM21_H1050-2
LSP1501-LSP1505 = Testpoint_Square: Testpoint, square; Part Number: Testpoint_Square
R1501 = gen_R_47k_0603: SMD Resistor 47k 0603; Tolerance: 1%; Power: 0.1W; Case EIA: 0603; Case Metric: 1608; Maximum Working Voltage: 75V; PnP Package: R_0603; Part Number: gen_R_47k_0603; Operating Temperature: -55°C - +155°C; Resistance: 47k; Series: E24; PnP Value: 47k; Supplier 1: Farnell; Supplier Part Number 1: 2073510
R1502-R1507 = gen_R_10k_0603: as R803 on sheet CAN_1; Part Number: gen_R_10k_0603; Operating Temperature: -55°C - +155°C; Resistance: 10k; Series: E24, E96; PnP Value: 10k; Supplier 1: Farnell; Supplier Part Number 1: 2073349
SLOT1501 = molex_47352-1001: 1.10mm Pitch Memorycard Card Connector, Push-Push Type, with VSS (Supply Voltage Ground) Detect Switch, Lead-Free; Manufacturer: Molex; Circuits: 10; Rated Voltage: 100V DC; Rated Current: 0.5A; Automotive Qualified: False; Part Number: molex_47352-1001; Part Name: 47352-1001; Operating Temperature: -20°C - +85°C; ComponentLink1Description: Drawing; ComponentLink1URL: http://www.molex.com/pdm_docs/sd/473521001_sd.pdf; Supplier 1: Farnell; Supplier Part Number 1: 2424133
T1501 = CMP-1099-00028-1: P-Channel SIPMOS Small-Signal-Transistor, -60 V VDS, -0.17 A ID, -55 to 150 degC, PG-SOT23, Reel, Green; Manufacturer: Infineon; VGS(th) (max): -2Â V; VGS(th) (min): -1Â V; VDS (max): -60Â V; Rth: 350Â K/W; Pto t (max): 0.36Â W; ID (max): -0.17Â A; IDpuls (max): -0.68Â A; RDS (on) (max) (@4.5V): 12,000Â mOhm; QG: 1Â nC; Green: TRUE; RDS (on) (max): 8,000Â mOhm; ComponentLink3URL: http://www.infineon.com/dgdl/SOT23-Package_Overview.pdf?folderId=db3a30431936bc4b0119532290053c66&fileId=db3a30431936bc4b0119533468123c85; ComponentLink3Description: Package Specification; Packing: Reel; PartNumber: BSS84P; ComponentLink2Description: Datasheet; Mounting Technology: Surface Mount; ComponentLink2URL: http://www.infineon.com/dgdl/BSS84P_Rev2.7%5B1%5D.pdf?folderId=db3a304314dca38901154a72e3951a65&fileId=db3a304330f68606013118ac7a9b4549; PackageReference: PG-SOT23; ComponentLink1URL: http://www.infineon.com/; PackageVersion: Apr-08; ComponentLink1Description: Manufacturer URL; PackageDescription: 3-Pin Small Outline Transistor Package, 2.9 x 1.3 mm Body, 0.95 mm Pitch; Halogen-free: TRUE; DatasheetVersion: Rev. 2.7

## Sheet analog_inputs_not_isolated.SchDoc: foxBMS BMS-Extension
size A3; DocumentNumber: 11; SheetNumber: 11; SheetTotal: 14; Author: Fraunhofer IISB foxBMS Team; REL-DATE: 2017-05-16; VERSION: 1.0.2; GateName_1: G$1; SymbolName_1: FRAME_B_L; LibraryName: foxBMS_BMS-Master_V1.00_A; DeviceSetName: FRAME_B_L; GateName_2: G$2; SymbolName_2: DOCFIELD; SheetDescription: Analog Inputs (not isolated)
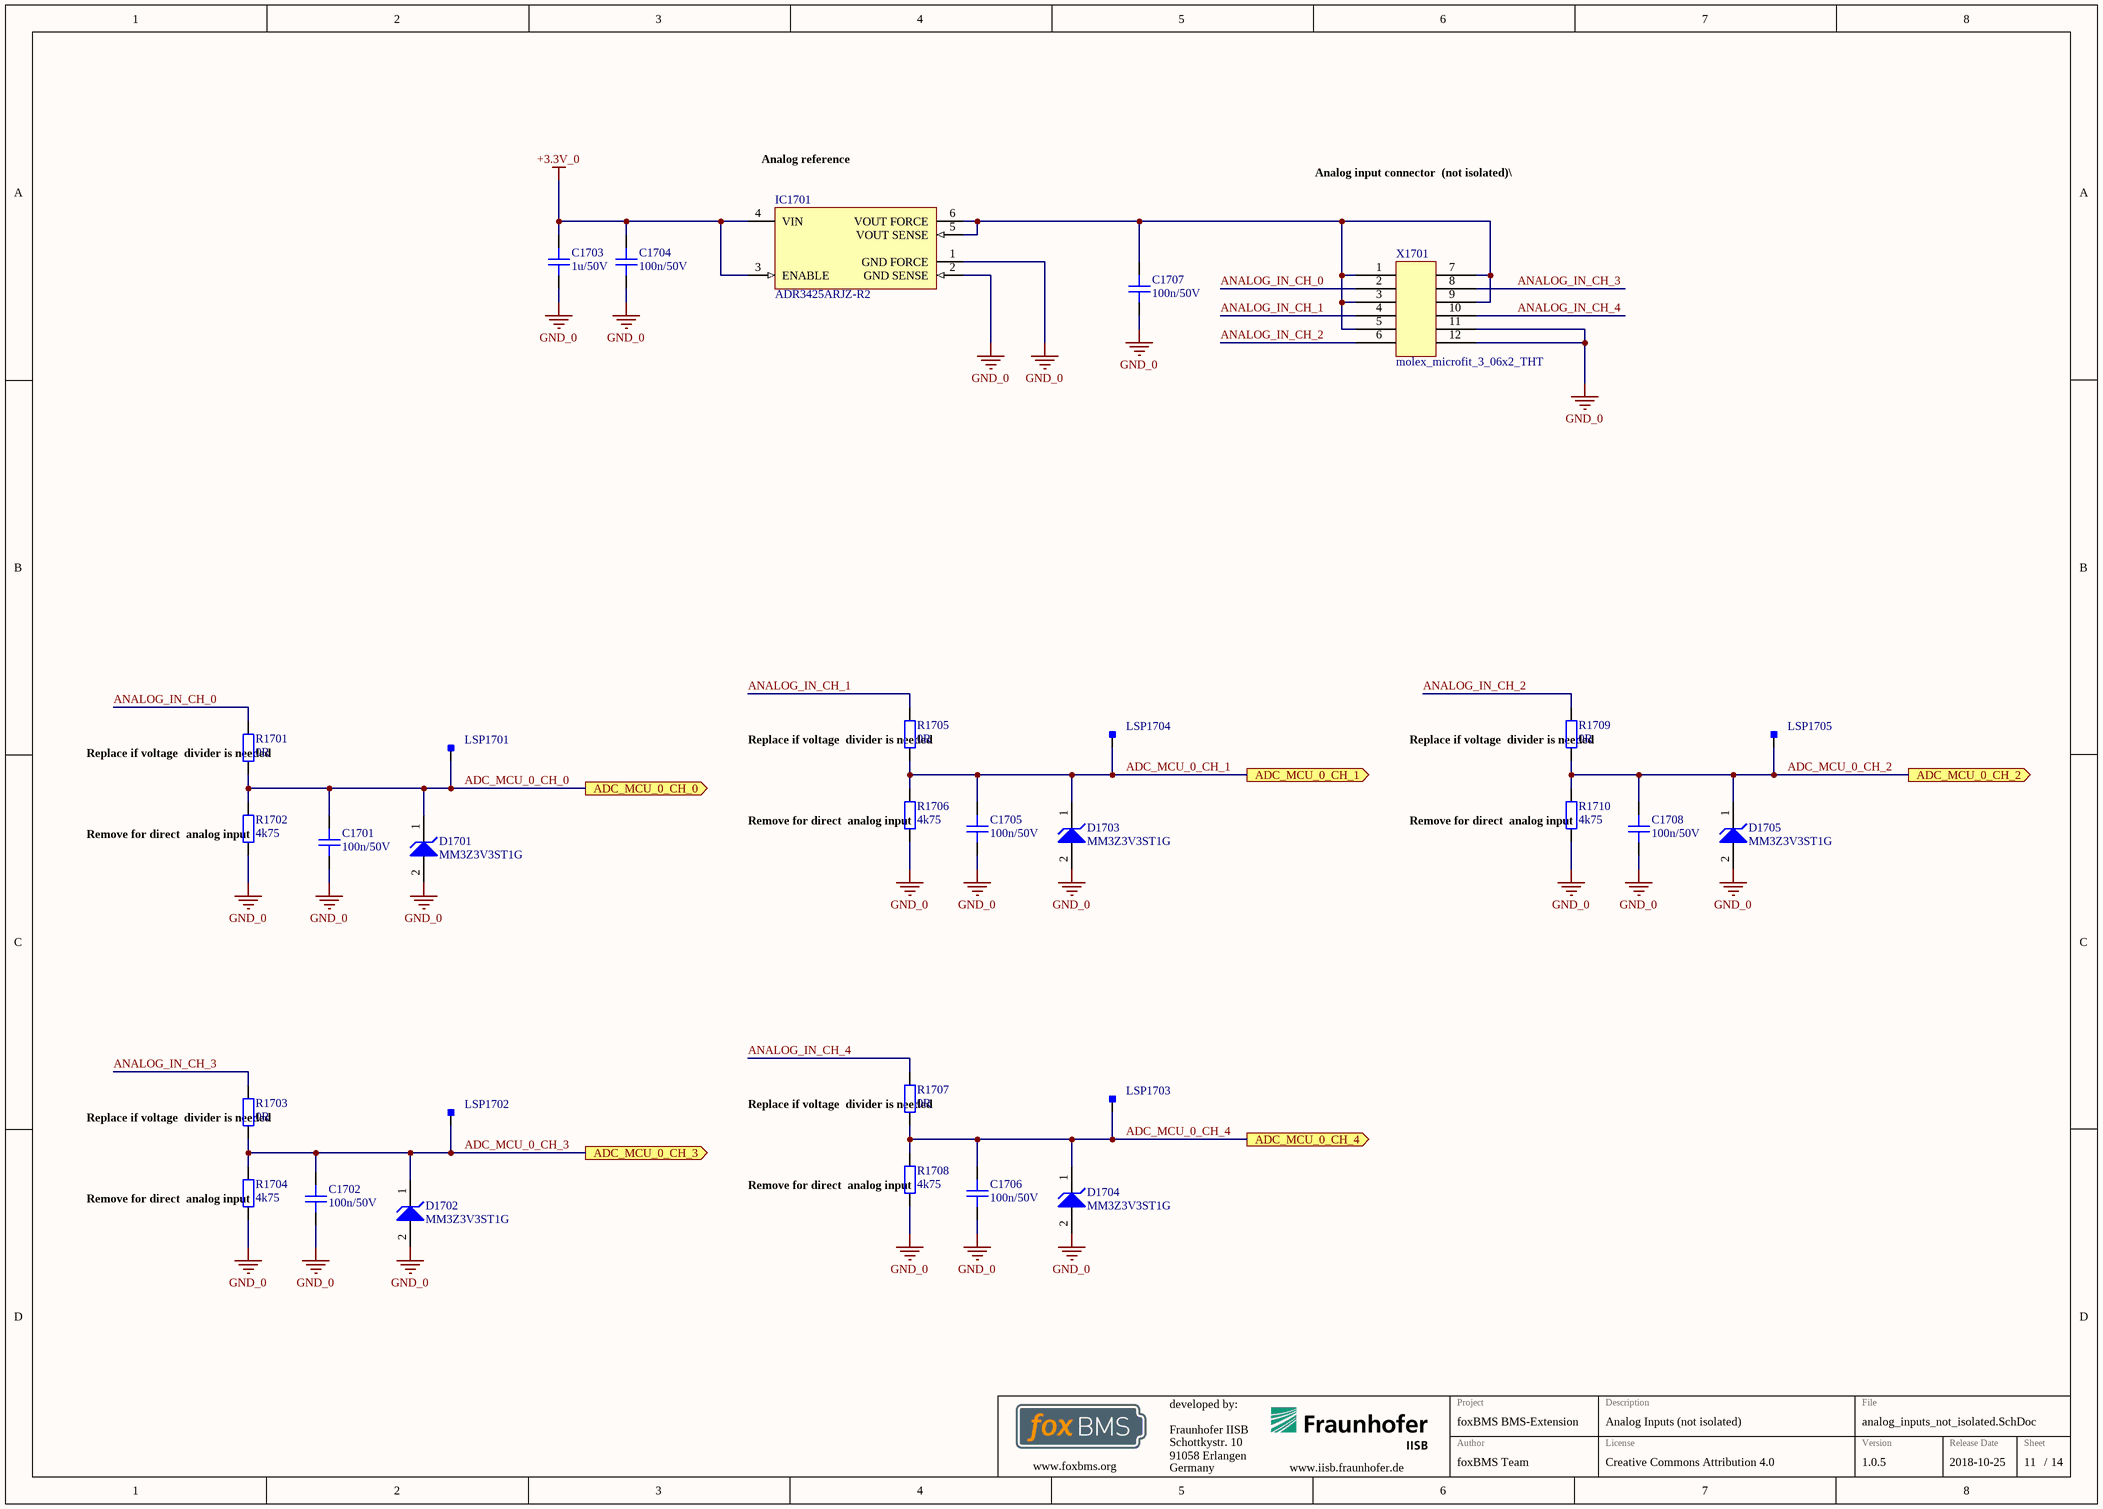
[diagram p5: analog_inputs_not_isolated.SchDoc]

### Parts
C1701  100n/50V  [CAPC1608X08N]
C1702  100n/50V  [CAPC1608X08N]
C1703  1u/50V  [CAPC1608X08N]
C1704  100n/50V  [CAPC1608X08N]
C1705  100n/50V  [CAPC1608X08N]
C1706  100n/50V  [CAPC1608X08N]
C1707  100n/50V  [CAPC1608X08N]
C1708  100n/50V  [CAPC1608X08N]
D1701  MM3Z3V3ST1G  [ONSC-SOD-323-2-477-02_V]
D1702  MM3Z3V3ST1G  [ONSC-SOD-323-2-477-02_V]
D1703  MM3Z3V3ST1G  [ONSC-SOD-323-2-477-02_V]
D1704  MM3Z3V3ST1G  [ONSC-SOD-323-2-477-02_V]
D1705  MM3Z3V3ST1G  [ONSC-SOD-323-2-477-02_V]
IC1701  ADR3425ARJZ-R2  [ADI-RJ-6_N]
LSP1701  Testpoint_Square  [Testpoint_S1]  (value not drawn)  (no BOM)
LSP1702  Testpoint_Square  [Testpoint_S1]  (value not drawn)  (no BOM)
LSP1703  Testpoint_Square  [Testpoint_S1]  (value not drawn)  (no BOM)
LSP1704  Testpoint_Square  [Testpoint_S1]  (value not drawn)  (no BOM)
LSP1705  Testpoint_Square  [Testpoint_S1]  (value not drawn)  (no BOM)
R1701  0R  [RESC1608X05N]
R1702  4k75  [RESC1608X05N]
R1703  0R  [RESC1608X05N]
R1704  4k75  [RESC1608X05N]
R1705  0R  [RESC1608X05N]
R1706  4k75  [RESC1608X05N]
R1707  0R  [RESC1608X05N]
R1708  4k75  [RESC1608X05N]
R1709  0R  [RESC1608X05N]
R1710  4k75  [RESC1608X05N]
X1701  molex_microfit_3_06x2_THT  [MOLEX_MICROFIT_06x2_THT]

### Ports
ADC_MCU_0_CH_0 (out), ADC_MCU_0_CH_1 (out), ADC_MCU_0_CH_2 (out), ADC_MCU_0_CH_3 (out), ADC_MCU_0_CH_4 (out)

### Nets
+3.3V_0: C1703.1 C1704.1 IC1701.3(ENABLE) IC1701.4(VIN)
GND_0: C1701.2 C1702.2 C1703.2 C1704.2 C1705.2 C1706.2 C1707.2 C1708.2 D1701.2(A) D1702.2(A) D1703.2(A) D1704.2(A) D1705.2(A) IC1701.1(GND_FORCE) IC1701.2(GND_SENSE) R1702.2 R1704.2 R1706.2 R1708.2 R1710.2 X1701.11 X1701.12
ADC_MCU_0_CH_0: C1701.1 D1701.1(K) LSP1701.1 R1701.2 R1702.1 ; port ADC_MCU_0_CH_0
ADC_MCU_0_CH_1: C1705.1 D1703.1(K) LSP1704.1 R1705.2 R1706.1 ; port ADC_MCU_0_CH_1
ADC_MCU_0_CH_2: C1708.1 D1705.1(K) LSP1705.1 R1709.2 R1710.1 ; port ADC_MCU_0_CH_2
ADC_MCU_0_CH_3: C1702.1 D1702.1(K) LSP1702.1 R1703.2 R1704.1 ; port ADC_MCU_0_CH_3
ADC_MCU_0_CH_4: C1706.1 D1704.1(K) LSP1703.1 R1707.2 R1708.1 ; port ADC_MCU_0_CH_4
ANALOG_IN_CH_0: R1701.1 X1701.2
ANALOG_IN_CH_1: R1705.1 X1701.4
ANALOG_IN_CH_2: R1709.1 X1701.6
ANALOG_IN_CH_3: R1703.1 X1701.8
ANALOG_IN_CH_4: R1707.1 X1701.10
NetC1707_1: C1707.1 IC1701.5(VOUT_SENSE) IC1701.6(VOUT_FORCE) X1701.1 X1701.3 X1701.5 X1701.7 X1701.9

### Notes on the sheet
- Analog reference
- Analog input connector
  (not isolated)\
- (near R1701) Replace if voltage
  divider is needed
- (near R1705) Replace if voltage
  divider is needed
- (near R1709) Replace if voltage
  divider is needed
- (near R1702) Remove for direct
  analog input
- (near R1706) Remove for direct
  analog input
- (near R1710) Remove for direct
  analog input
- (near R1703) Replace if voltage
  divider is needed
- (near R1707) Replace if voltage
  divider is needed
- (near R1708) Remove for direct
  analog input
- (near R1704) Remove for direct
  analog input
- Fraunhofer IISB
- Schottkystr. 10
- developed by:
- 91058 Erlangen
- Germany
- Author
- Project
- License
- Description
- File
- Version
- Release Date
- Sheet
- www.foxbms.org
- www.iisb.fraunhofer.de
- foxBMS Team
- /

### Library data of the parts
C1701 C1702 C1704-C1708 = gen_C_ceramic_100n_50V_X7R_0603: as C802 on sheet CAN_1; Part Number: gen_C_ceramic_100n_50V_X7R_0603; Supplier 1: Farnell; Supplier Part Number 1: 2525267
C1703 = gen_C_ceramic_1u_50V_X7R_0603: as C1301 on sheet isolated_rs485; Part Number: gen_C_ceramic_1u_50V_X7R_0603; Operating Temperature: -55°C - +125°C; Supplier 1: Farnell; Supplier Part Number 1: 2779055
D1701-D1705 = CMP-1060-00652-1: Zener Voltage Regulator, 300 mW, Tight Tolerance Portfolio, 2-Pin SOD-323, Pb-Free, Tape and Reel; Manufacturer: On Semiconductor; P Max (W): 0.3; PartNumber: MM3Z3V3ST1G; DatasheetVersion: Rev. 21; PackageVersion: Rev. H, 03/2007; Packing: Tape and Reel; PackageReference: SOD-323-2-477-02; RoHS: Pb-Free; Mounting Technology: Surface Mount; ComponentLink2URL: http://www.onsemi.cn/pub_link/Collateral/MM3Z2V4ST1-D.PDF; ComponentLink1URL: http://www.onsemi.com/; ComponentLink2Description: Datasheet; ComponentLink1Description: Manufacturer URL; ComponentLink3Description: Package Specification; PackageDescription: 2-Pin SOD, Body 1.7 x 1.25 mm; ComponentLink3URL: http://www.onsemi.com/pub_link/Collateral/477-02.PDF.1
IC1701 = CMP-0784-00366-1: Micropower, High Accuracy Voltage Reference, 2.5 V Output, 2.7 to 5.5 V Supply, Industrial, 6-pin SOT23 (RJ-6), Reel; Manufacturer: Analog Devices; Vout: 2.5V; Ref Out TC (ppm/C): 2.5; Min V Supply (V): 2.7; Max V Supply (V): 5.5; ComponentLink3URL: http://www.analog.com/static/imported-files/packages/PKG_PDF/SOT-23(RJ)/RJ_6.pdf; Mounting Technology: Surface Mount; Packing: Reel; ComponentLink3Description: Package Specification; Code_JEDEC: MO-178-AB; PackageReference: RJ-6; Operating Temp Range: -40 to 125 degC; PartNumber: ADR3425ARJZ-R2; ComponentLink2Description: Datasheet; PackageDescription: 6-Pin Small Outline Transistor Package, Body 2.9 x 1.6 mm, Pitch 0.95 mm; ComponentLink1URL: http://www.analog.com/en/index.html; ComponentLink2URL: http://www.analog.com/static/imported-files/data_sheets/ADR3412_ADR3420_ADR3425_ADR3430_ADR3433_ADR3440_ADR3450.pdf; ComponentLink1Description: Manufacturer URL; PackageVersion: 121608-A, 12/2008; ComponentLink4URL: Product URL:http://www.analog.com/en/special-linear-functions/voltage-references/adr3425/products/product.html; ComponentLink4Description: URL Link1; DatasheetVersion: Rev. B
LSP1701-LSP1705 = Testpoint_Square: Testpoint, square; Part Number: Testpoint_Square
R1701 R1703 R1705 R1707 R1709 = gen_R_0R_0603: SMD Resistor 0R 0603; Power: 0.1W; Case EIA: 0603; Case Metric: 1608; PnP Package: R_0603; Maximum Working Voltage: 75V; Part Number: gen_R_0R_0603; Operating Temperature: -55°C - +155°C; Resistance: 0R; Series: Jumper; PnP Value: 0R; Supplier 1: Farnell; Supplier Part Number 1: 2073345
R1702 R1704 R1706 R1708 R1710 = gen_R_4k75_0603: SMD Resistor 4k75 0603; Tolerance: 1%; Power: 0.1W; Case EIA: 0603; Case Metric: 1608; Maximum Working Voltage: 75V; PnP Package: R_0603; Part Number: gen_R_4k75_0603; Operating Temperature: -55°C - +155°C; Resistance: 4k75; Series: E96; PnP Value: 4k75; Supplier 1: Farnell; Supplier Part Number 1: 2073517
X1701 = molex_microfit_3_06x2_THT: Micro-Fit 3.0 Right Angle Header, 3.00mm Pitch, Dual Row, 12 Circuits, with Snap-in Plastic Peg PCB Lock, Tin, Glow Wire Capable, Black, 43045-1200; Manufacturer: Molex; Circuits: 12; Rated Current: 8.5A; Rated Voltage: 600V; Part Number: molex_microfit_3_06x2_THT; Operating Temperature: -40°C - +105°C; Part Name: MicroFit; Supplier 1: Farnell; Supplier Part Number 1: 9732977

## Sheet iso_GPIO_4in_4out.SchDoc: foxBMS BMS-Extension
size A3; DocumentNumber: 12; SheetNumber: 12; SheetTotal: 14; Author: Fraunhofer IISB foxBMS Team; REL-DATE: 2017-05-16; VERSION: 1.0.2; GateName_1: G$1; SymbolName_1: FRAME_B_L; LibraryName: foxBMS_BMS-Master_V1.00_A; DeviceSetName: FRAME_B_L; GateName_2: G$2; SymbolName_2: DOCFIELD; SheetDescription: Isolated GPIO 4x In / 4x Out
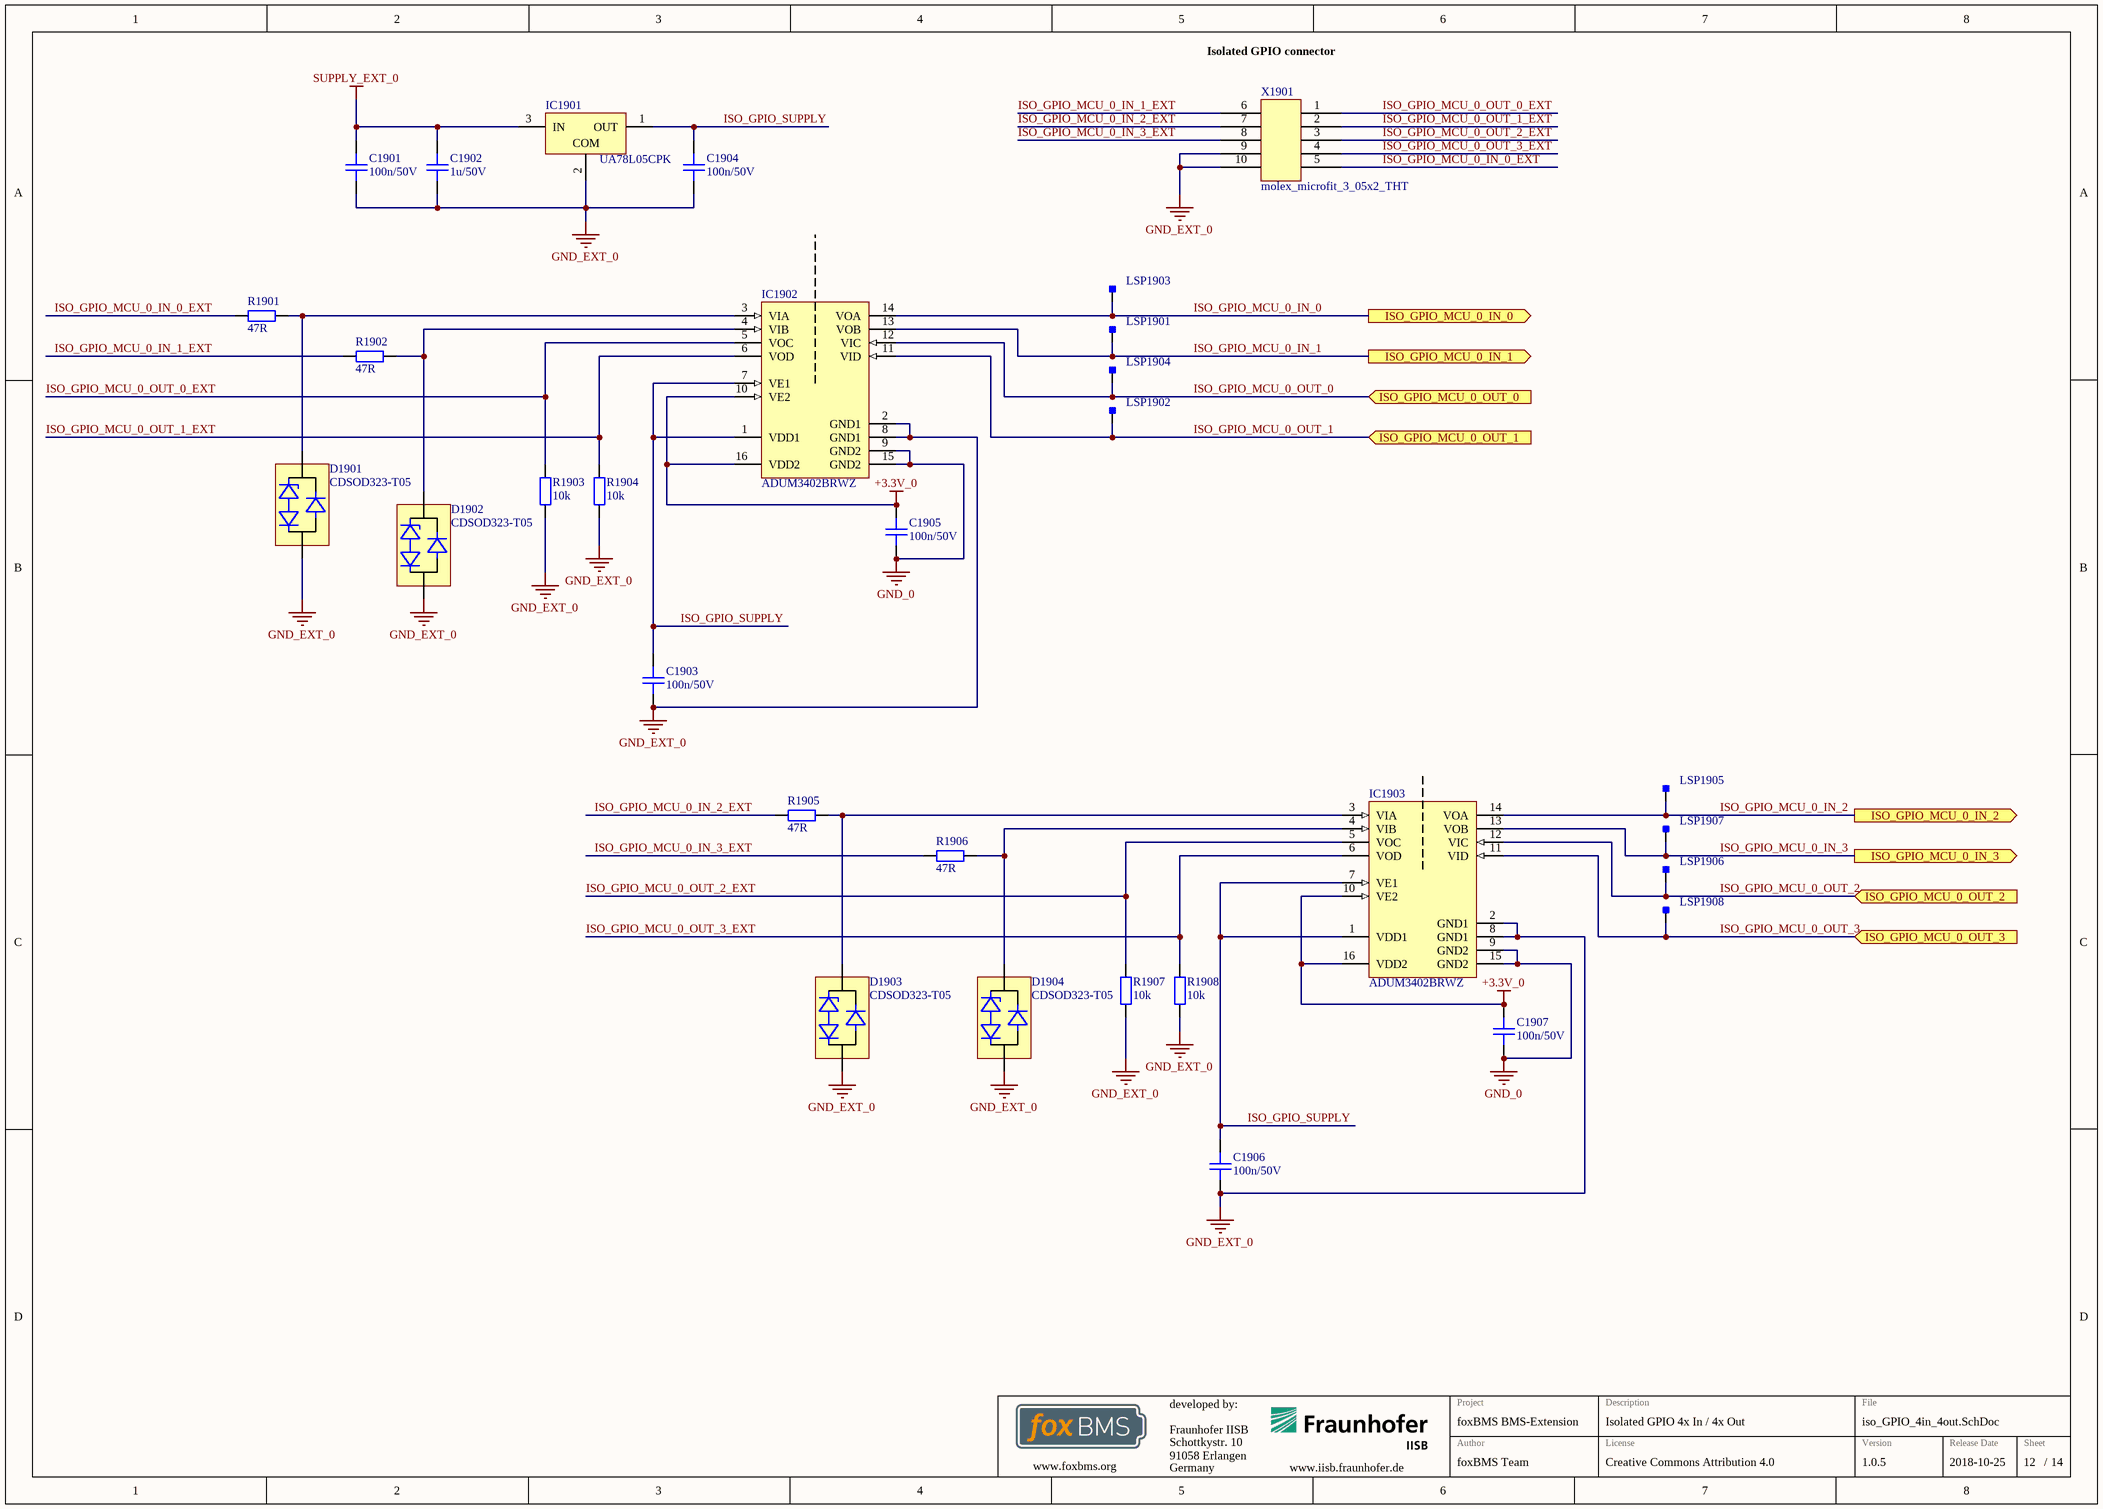
[diagram p6: iso_GPIO_4in_4out.SchDoc]

### Parts
C1901  100n/50V  [CAPC1608X08N]
C1902  1u/50V  [CAPC1608X08N]
C1903  100n/50V  [CAPC1608X08N]
C1904  100n/50V  [CAPC1608X08N]
C1905  100n/50V  [CAPC1608X08N]
C1906  100n/50V  [CAPC1608X08N]
C1907  100n/50V  [CAPC1608X08N]
D1901  CDSOD323-T05  [SODFL250X110-2N]
D1902  CDSOD323-T05  [SODFL250X110-2N]
D1903  CDSOD323-T05  [SODFL250X110-2N]
D1904  CDSOD323-T05  [SODFL250X110-2N]
IC1901  UA78L05CPK  [PK0003A_L]
IC1902  ADUM3402BRWZ  [ADI-RW-16_N]
IC1903  ADUM3402BRWZ  [ADI-RW-16_N]
LSP1901  Testpoint_Square  [Testpoint_S1]  (value not drawn)  (no BOM)
LSP1902  Testpoint_Square  [Testpoint_S1]  (value not drawn)  (no BOM)
LSP1903  Testpoint_Square  [Testpoint_S1]  (value not drawn)  (no BOM)
LSP1904  Testpoint_Square  [Testpoint_S1]  (value not drawn)  (no BOM)
LSP1905  Testpoint_Square  [Testpoint_S1]  (value not drawn)  (no BOM)
LSP1906  Testpoint_Square  [Testpoint_S1]  (value not drawn)  (no BOM)
LSP1907  Testpoint_Square  [Testpoint_S1]  (value not drawn)  (no BOM)
LSP1908  Testpoint_Square  [Testpoint_S1]  (value not drawn)  (no BOM)
R1901  47R  [RESC1608X05N]
R1902  47R  [RESC1608X05N]
R1903  10k  [RESC1608X05N]
R1904  10k  [RESC1608X05N]
R1905  47R  [RESC1608X05N]
R1906  47R  [RESC1608X05N]
R1907  10k  [RESC1608X05N]
R1908  10k  [RESC1608X05N]
X1901  molex_microfit_3_05x2_THT  [MOLEX_MICROFIT_05x2_THT]

### Ports
ISO_GPIO_MCU_0_IN_0 (out), ISO_GPIO_MCU_0_IN_1 (out), ISO_GPIO_MCU_0_IN_2 (out), ISO_GPIO_MCU_0_IN_3 (out), ISO_GPIO_MCU_0_OUT_0 (in), ISO_GPIO_MCU_0_OUT_1 (in), ISO_GPIO_MCU_0_OUT_2 (in), ISO_GPIO_MCU_0_OUT_3 (in)

### Nets
+3.3V_0: C1905.1 C1907.1 IC1902.10(VE2) IC1902.16(VDD2) IC1903.10(VE2) IC1903.16(VDD2)
GND_0: C1905.2 C1907.2 IC1902.9(GND2) IC1902.15(GND2) IC1903.9(GND2) IC1903.15(GND2)
GND_EXT_0: C1901.2 C1902.2 C1903.2 C1904.2 C1906.2 D1901.2(A) D1902.2(A) D1903.2(A) D1904.2(A) IC1901.2(COM) IC1902.2(GND1) IC1902.8(GND1) IC1903.2(GND1) IC1903.8(GND1) R1903.1 R1904.1 R1907.1 R1908.1 X1901.9 X1901.10
SUPPLY_EXT_0: C1901.1 C1902.1 IC1901.3(IN)
ISO_GPIO_MCU_0_IN_0: IC1902.14(VOA) LSP1903.1 ; port ISO_GPIO_MCU_0_IN_0
ISO_GPIO_MCU_0_IN_0_EXT: R1901.2 X1901.5
ISO_GPIO_MCU_0_IN_1: IC1902.13(VOB) LSP1901.1 ; port ISO_GPIO_MCU_0_IN_1
ISO_GPIO_MCU_0_IN_1_EXT: R1902.2 X1901.6
ISO_GPIO_MCU_0_IN_2: IC1903.14(VOA) LSP1905.1 ; port ISO_GPIO_MCU_0_IN_2
ISO_GPIO_MCU_0_IN_2_EXT: R1905.2 X1901.7
ISO_GPIO_MCU_0_IN_3: IC1903.13(VOB) LSP1907.1 ; port ISO_GPIO_MCU_0_IN_3
ISO_GPIO_MCU_0_IN_3_EXT: R1906.2 X1901.8
ISO_GPIO_MCU_0_OUT_0: IC1902.12(VIC) LSP1904.1 ; port ISO_GPIO_MCU_0_OUT_0
ISO_GPIO_MCU_0_OUT_0_EXT: IC1902.5(VOC) R1903.2 X1901.1
ISO_GPIO_MCU_0_OUT_1: IC1902.11(VID) LSP1902.1 ; port ISO_GPIO_MCU_0_OUT_1
ISO_GPIO_MCU_0_OUT_1_EXT: IC1902.6(VOD) R1904.2 X1901.2
ISO_GPIO_MCU_0_OUT_2: IC1903.12(VIC) LSP1906.1 ; port ISO_GPIO_MCU_0_OUT_2
ISO_GPIO_MCU_0_OUT_2_EXT: IC1903.5(VOC) R1907.2 X1901.3
ISO_GPIO_MCU_0_OUT_3: IC1903.11(VID) LSP1908.1 ; port ISO_GPIO_MCU_0_OUT_3
ISO_GPIO_MCU_0_OUT_3_EXT: IC1903.6(VOD) R1908.2 X1901.4
ISO_GPIO_SUPPLY: C1903.1 C1904.1 C1906.1 IC1901.1(OUT) IC1902.1(VDD1) IC1902.7(VE1) IC1903.1(VDD1) IC1903.7(VE1)
NetD1901_1: D1901.1(K) IC1902.3(VIA) R1901.1
NetD1902_1: D1902.1(K) IC1902.4(VIB) R1902.1
NetD1903_1: D1903.1(K) IC1903.3(VIA) R1905.1
NetD1904_1: D1904.1(K) IC1903.4(VIB) R1906.1

### Notes on the sheet
- Isolated GPIO connector
- Fraunhofer IISB
- Schottkystr. 10
- developed by:
- 91058 Erlangen
- Germany
- Author
- Project
- License
- Description
- File
- Version
- Release Date
- Sheet
- www.foxbms.org
- www.iisb.fraunhofer.de
- foxBMS Team
- /

### Library data of the parts
C1901 C1903-C1907 = gen_C_ceramic_100n_50V_X7R_0603: as C802 on sheet CAN_1; Part Number: gen_C_ceramic_100n_50V_X7R_0603; Supplier 1: Farnell; Supplier Part Number 1: 2525267
C1902 = gen_C_ceramic_1u_50V_X7R_0603: as C1301 on sheet isolated_rs485; Part Number: gen_C_ceramic_1u_50V_X7R_0603; Operating Temperature: -55°C - +125°C; Supplier 1: Farnell; Supplier Part Number 1: 2779055
D1901-D1904 = CDSOD323-T05: TVS Diode, CDSOD323 Series, Unidirectional, 5 V, 18.3 V, SOD-323, 2 Pins; Manufacturer: Bourns; Breakdown Voltage: 6V; Part Number: CDSOD323-T05; Part Name: CDSOD323-T05; Operating Temperature: -55°C - +150°C; ComponentLink1Description: Datasheet; ComponentLink1URL: http://www.farnell.com/datasheets/1845299.pdf; Supplier 1: Farnell; Supplier Part Number 1: 2341914
IC1901 = CMP-2000-07341-1: as IC1301 on sheet isolated_rs485; Mounting Style: SMD/SMT; Datasheet Version: Rev. U, 05/2011; Polarity: Positive; Minimum Operating Temperature: 0C; Package Reference: PK0003A; Brand: TexasInstruments; Packaging: Reel; Product Category: LinearVoltageRegulators; RoHS: True; Datasheet URL: http://www.ti.com/lit/ds/symlink/ua78l05.pdf; Package URL: http://www.ti.com/lit/ml/mhsi001b/mhsi001b.pdf; Series: UA78L05; Manufacturer URL: http://www.ti.com/; Package Description: 3-Pin Small Outline Transistor, Body 4.5 x 2.5 mm, Pitch 1.5 mm; Mounting Technology: SurfaceMount; Package / Case: SOT-89-4; Maximum Operating Temperature: +125C
IC1902 IC1903 = CMP-0534-00413-1: Quad Channel Digital Isolator, Enhanced System-Level ESD Reliability, 2.5 KV rms Insulation Rating, 10 Mbps Data Rate, 50 ns Delay, Industrial, 16-pin SOIC (RW-16), Tube; Manufacturer: Analog Devices; Max Data Rate: 10Mbps; Insulation Rating (kVrms): 2.5; PackageVersion: 032707-B, 03/2007; ComponentLink4Description: URL Link1; ComponentLink2Description: Datasheet; ComponentLink3URL: http://www.analog.com/static/imported-files/packages/PKG_PDF/SOIC_WIDE%20%28RW%29/RW_16.pdf; PackageDescription: 16-Pin Standard Small Outline Package, Body 10.3 x 7.5 mm, Pitch 1.27 mm; PackageReference: RW-16; ComponentLink4URL: Product URL:http://www.analog.com/en/interface-isolation/digital-isolators/adum3402/products/product.html; Mounting Technology: Surface Mount; PartNumber: ADUM3402BRWZ; ComponentLink2URL: http://www.analog.com/static/imported-files/data_sheets/ADUM3400_3401_3402.pdf; ComponentLink3Description: Package Specification; Code_JEDEC: MS-013-AA; Max Operating Temp (degreesC): 105; ComponentLink1URL: http://www.analog.com/en/index.html; ComponentLink1Description: Manufacturer URL; DatasheetVersion: Rev. B
LSP1901-LSP1908 = Testpoint_Square: Testpoint, square; Part Number: Testpoint_Square
R1901 R1902 R1905 R1906 = gen_R_47R_0603: SMD Resistor 47R 0603; Tolerance: 1%; Power: 0.1W; Case EIA: 0603; Case Metric: 1608; Maximum Working Voltage: 75V; PnP Package: R_0603; Part Number: gen_R_47R_0603; Operating Temperature: -55°C - +155°C; Resistance: 47R; Series: E24; PnP Value: 47R; Supplier 1: Farnell; Supplier Part Number 1: 2303030
R1903 R1904 R1907 R1908 = gen_R_10k_0603: as R803 on sheet CAN_1; Part Number: gen_R_10k_0603; Operating Temperature: -55°C - +155°C; Resistance: 10k; Series: E24, E96; PnP Value: 10k; Supplier 1: Farnell; Supplier Part Number 1: 2073349
X1901 = molex_microfit_3_05x2_THT: Micro-Fit 3.0 Right Angle Header, 3.00mm Pitch, Dual Row, 10 Circuits, with Snap-in Plastic Peg PCB Lock, Tin, Glow Wire Capable, Black, 43045-1000; Manufacturer: Molex; Circuits: 10; Rated Voltage: 600V; Rated Current: 8.5A; Part Number: molex_microfit_3_05x2_THT; Part Name: MicroFit; Operating Temperature: -40°C - +105°C; Supplier 1: Farnell; Supplier Part Number 1: 1012255